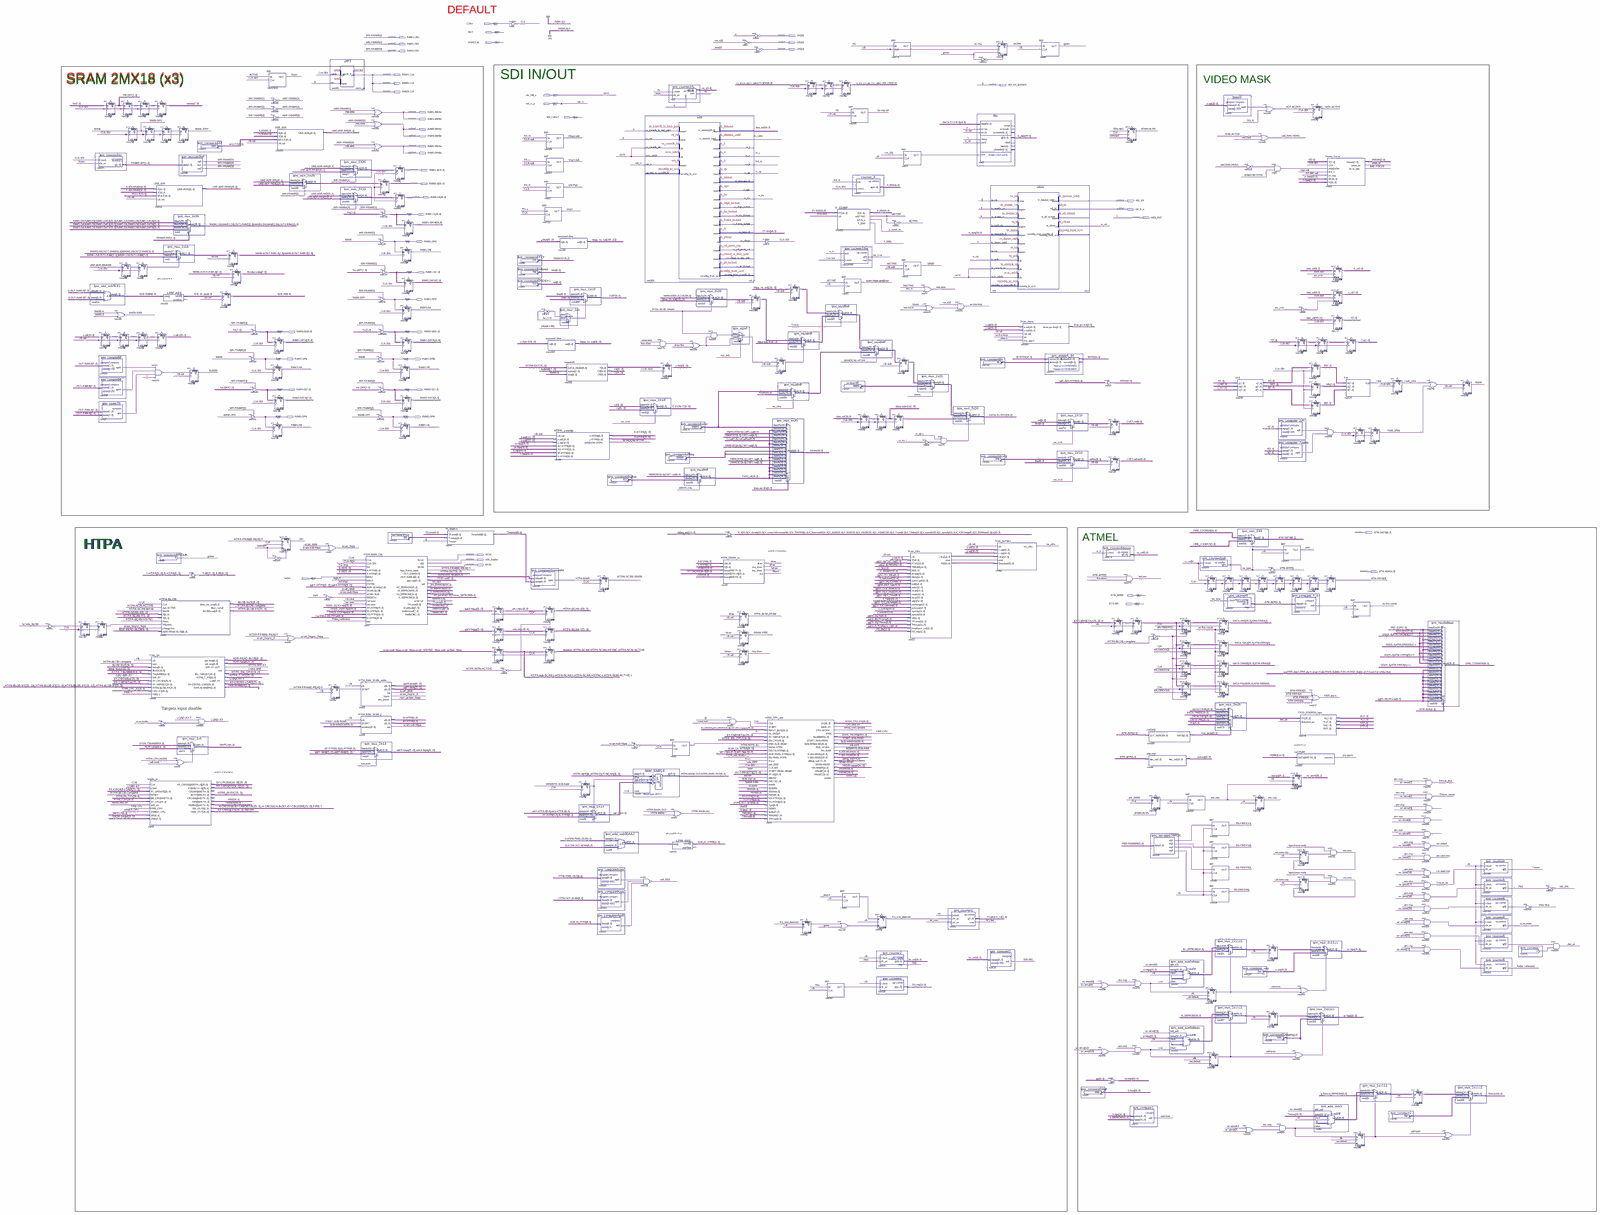
[diagram p0: schematic sheet, whole]
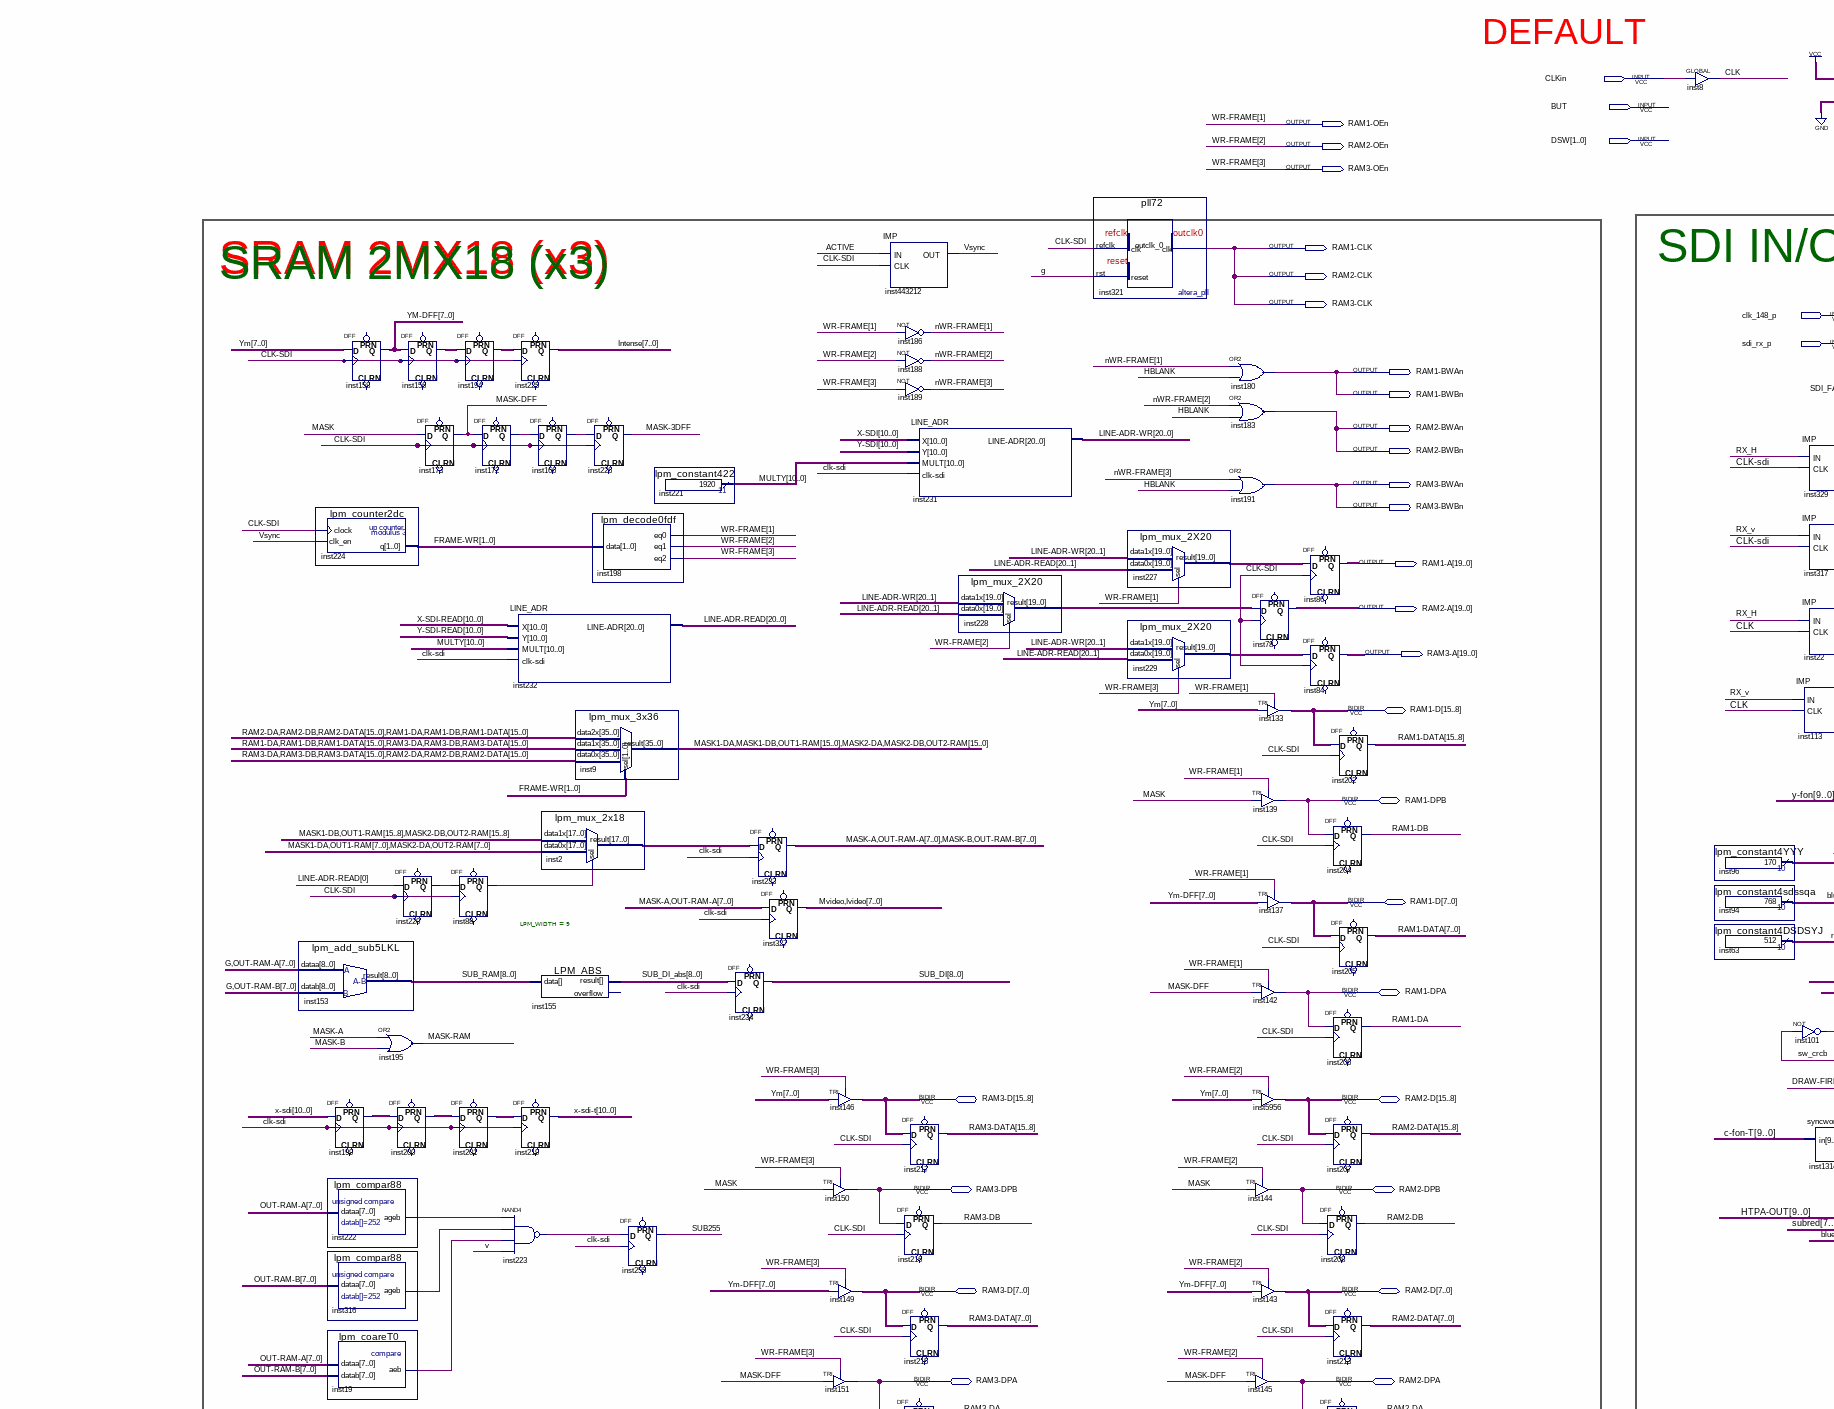
[diagram p1: schematic sheet, upper left part]
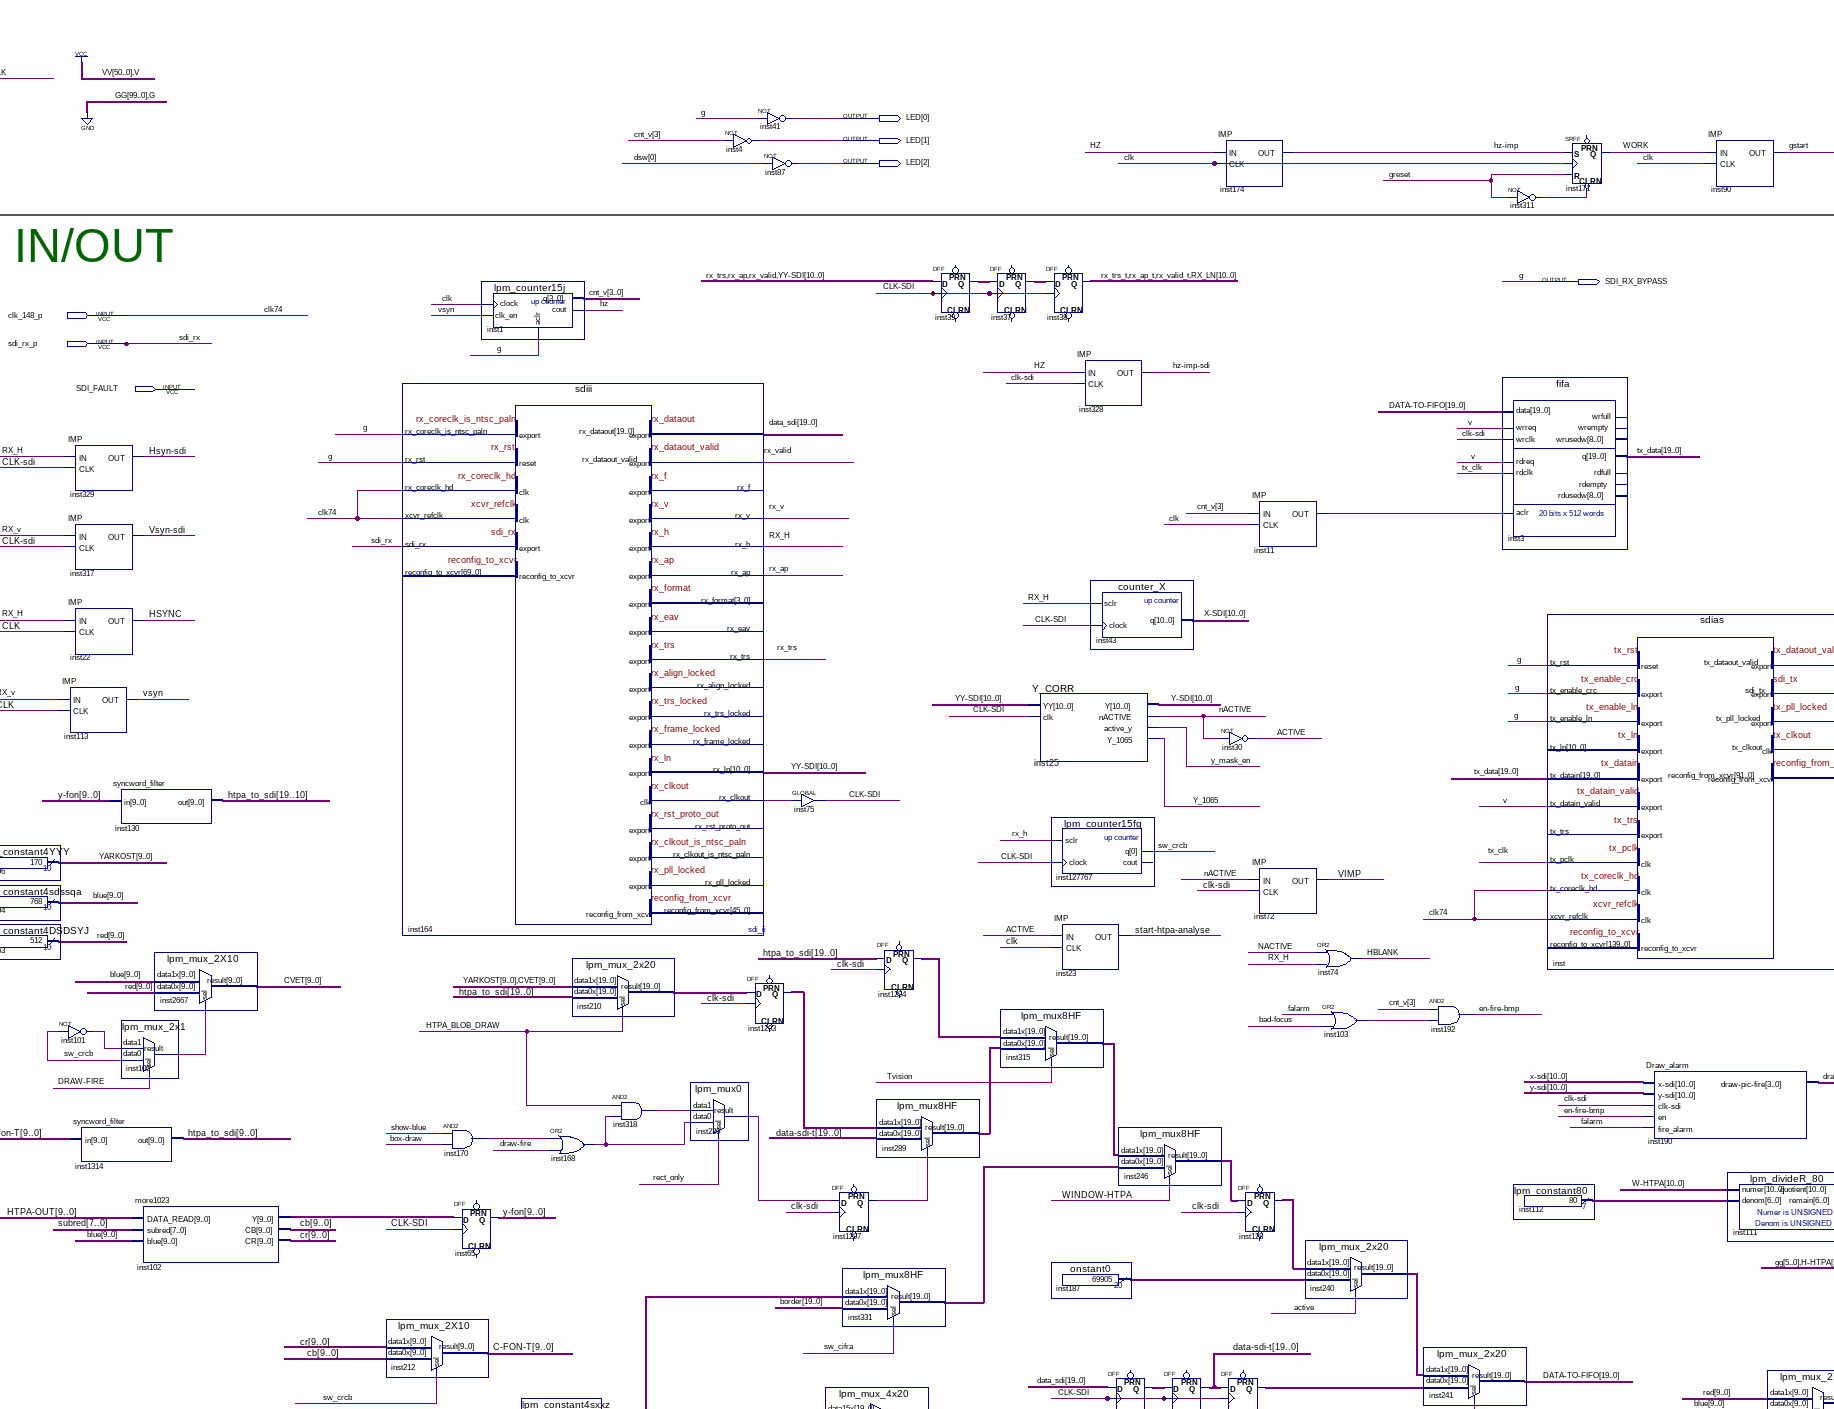
[diagram p2: schematic sheet, upper centre part]
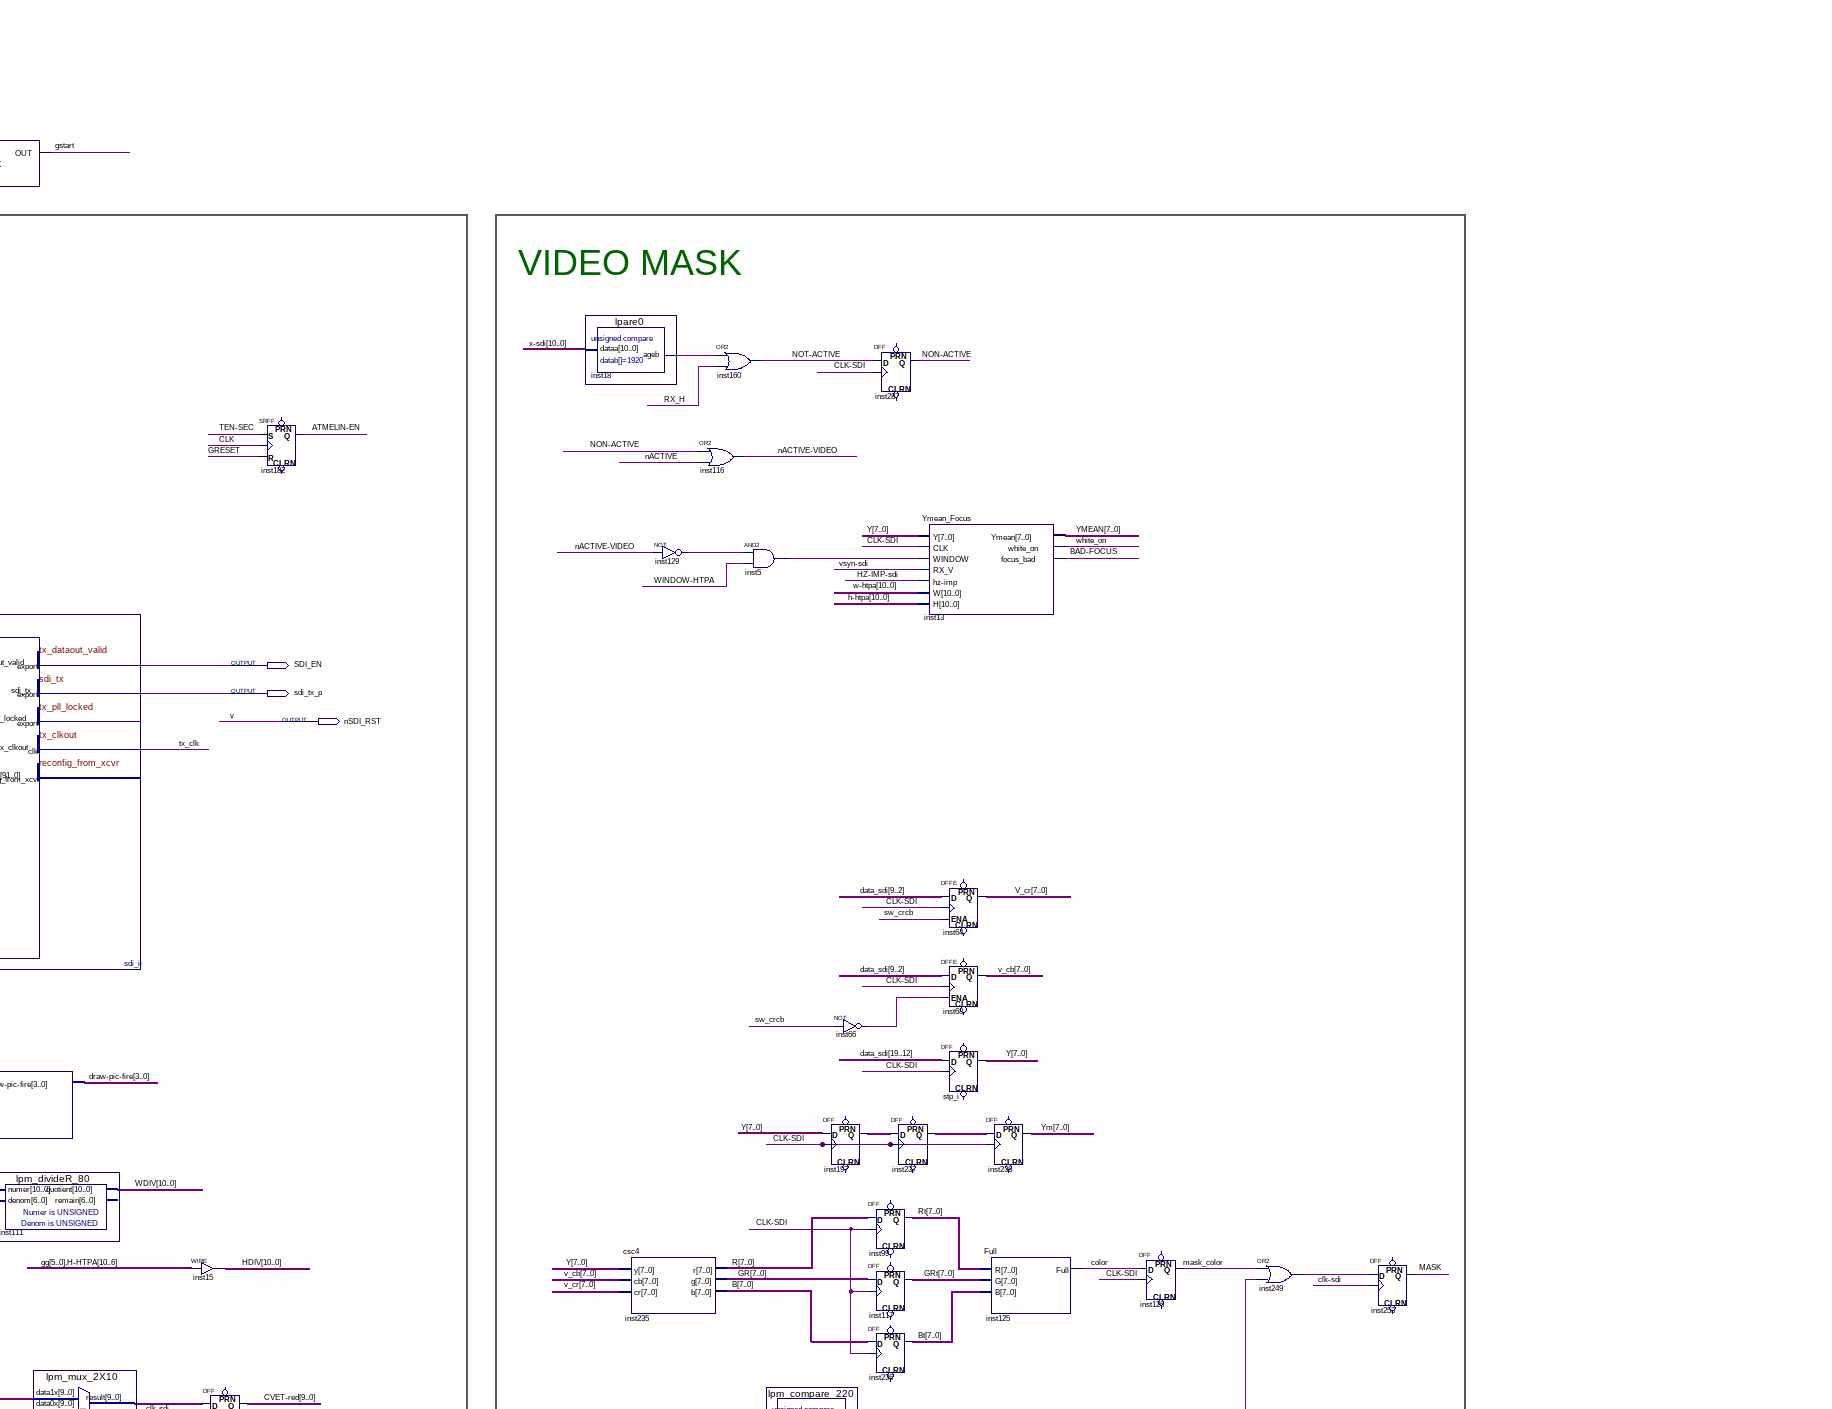
[diagram p3: schematic sheet, upper right part]
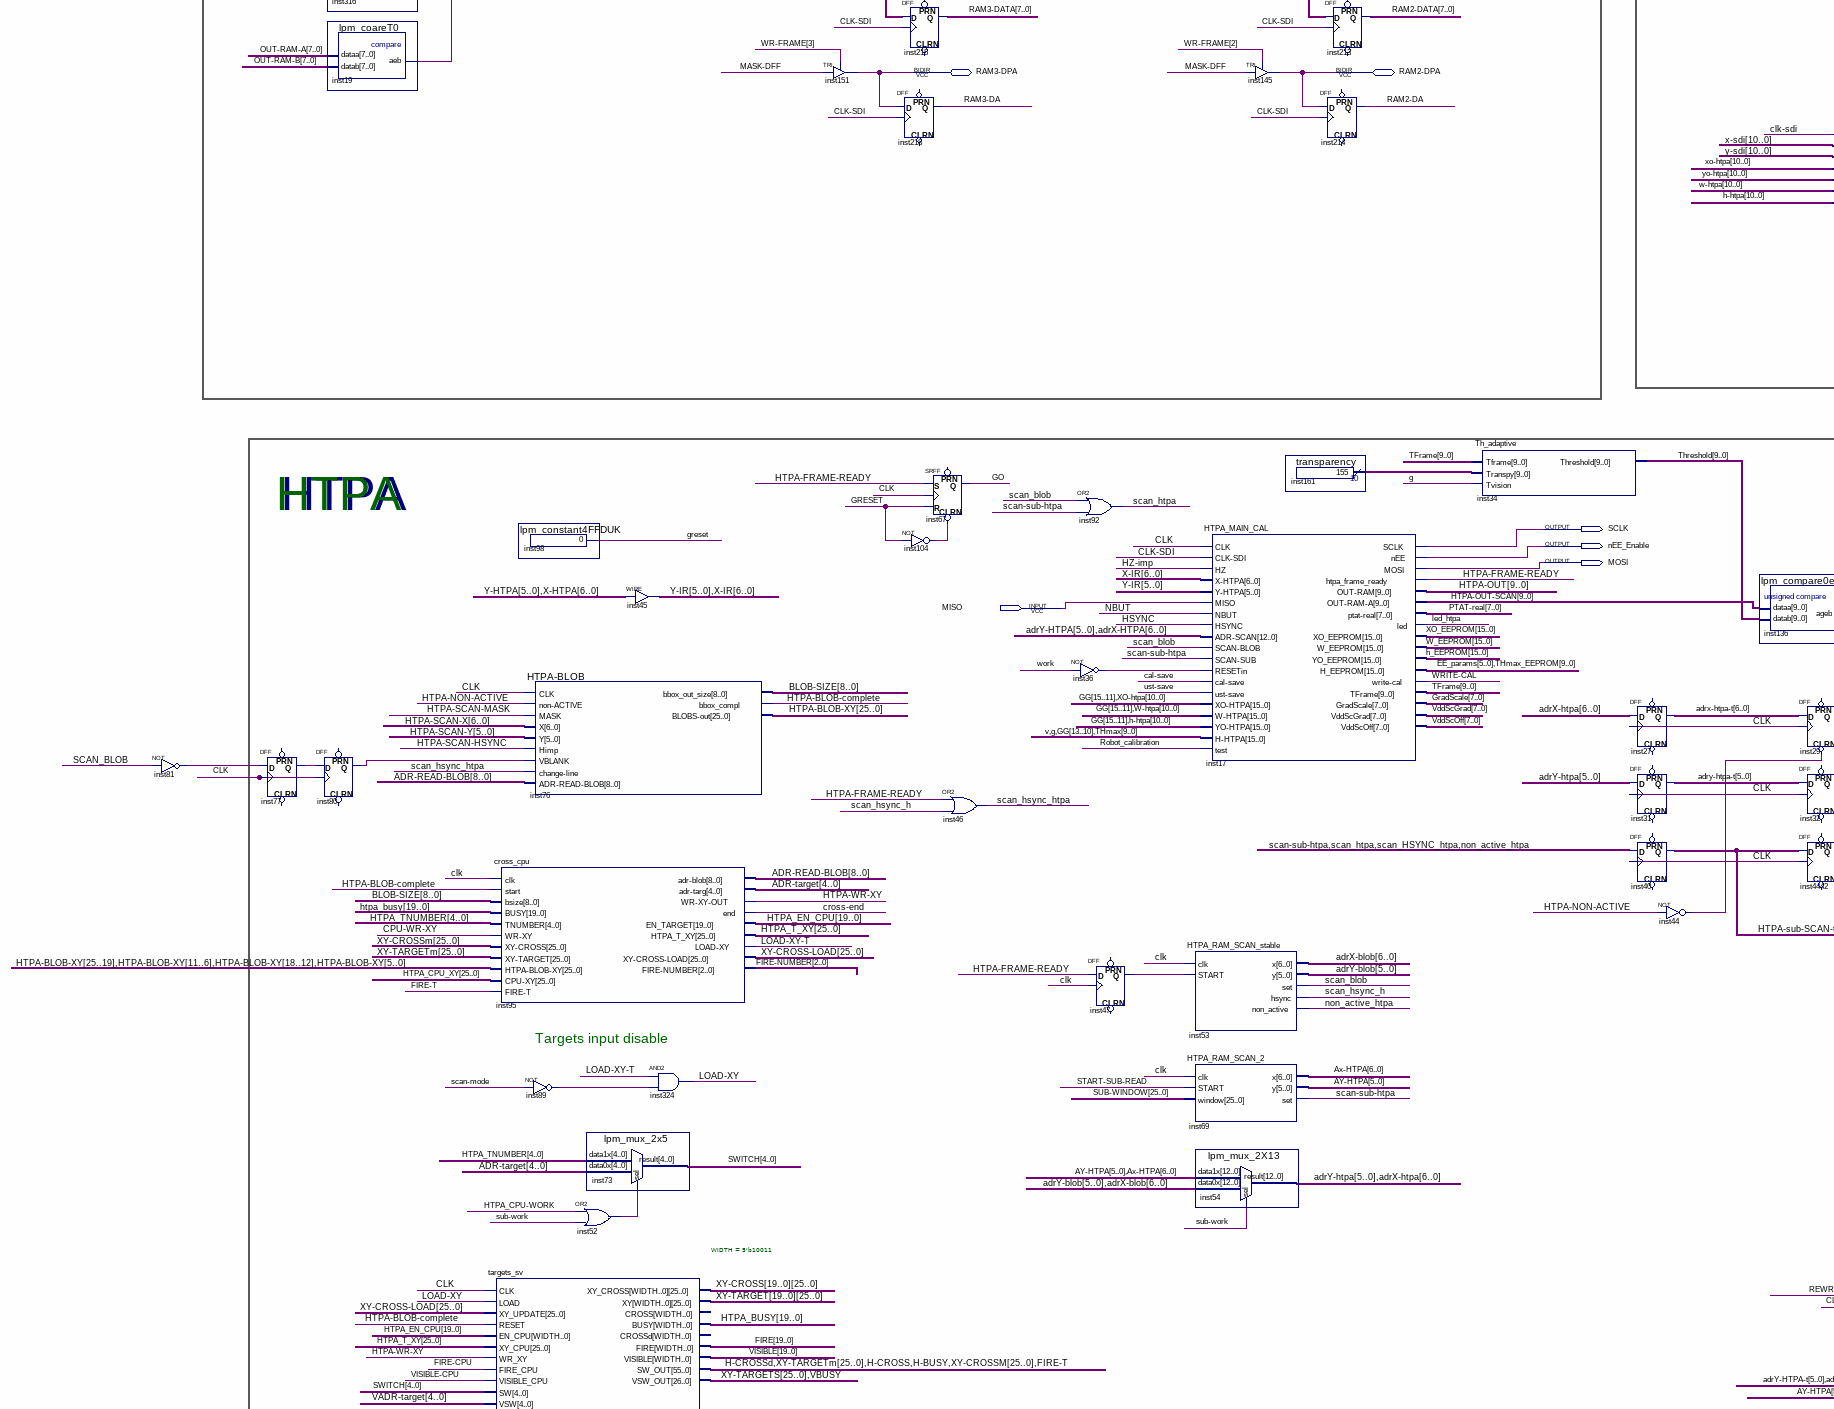
[diagram p4: schematic sheet, middle left part]
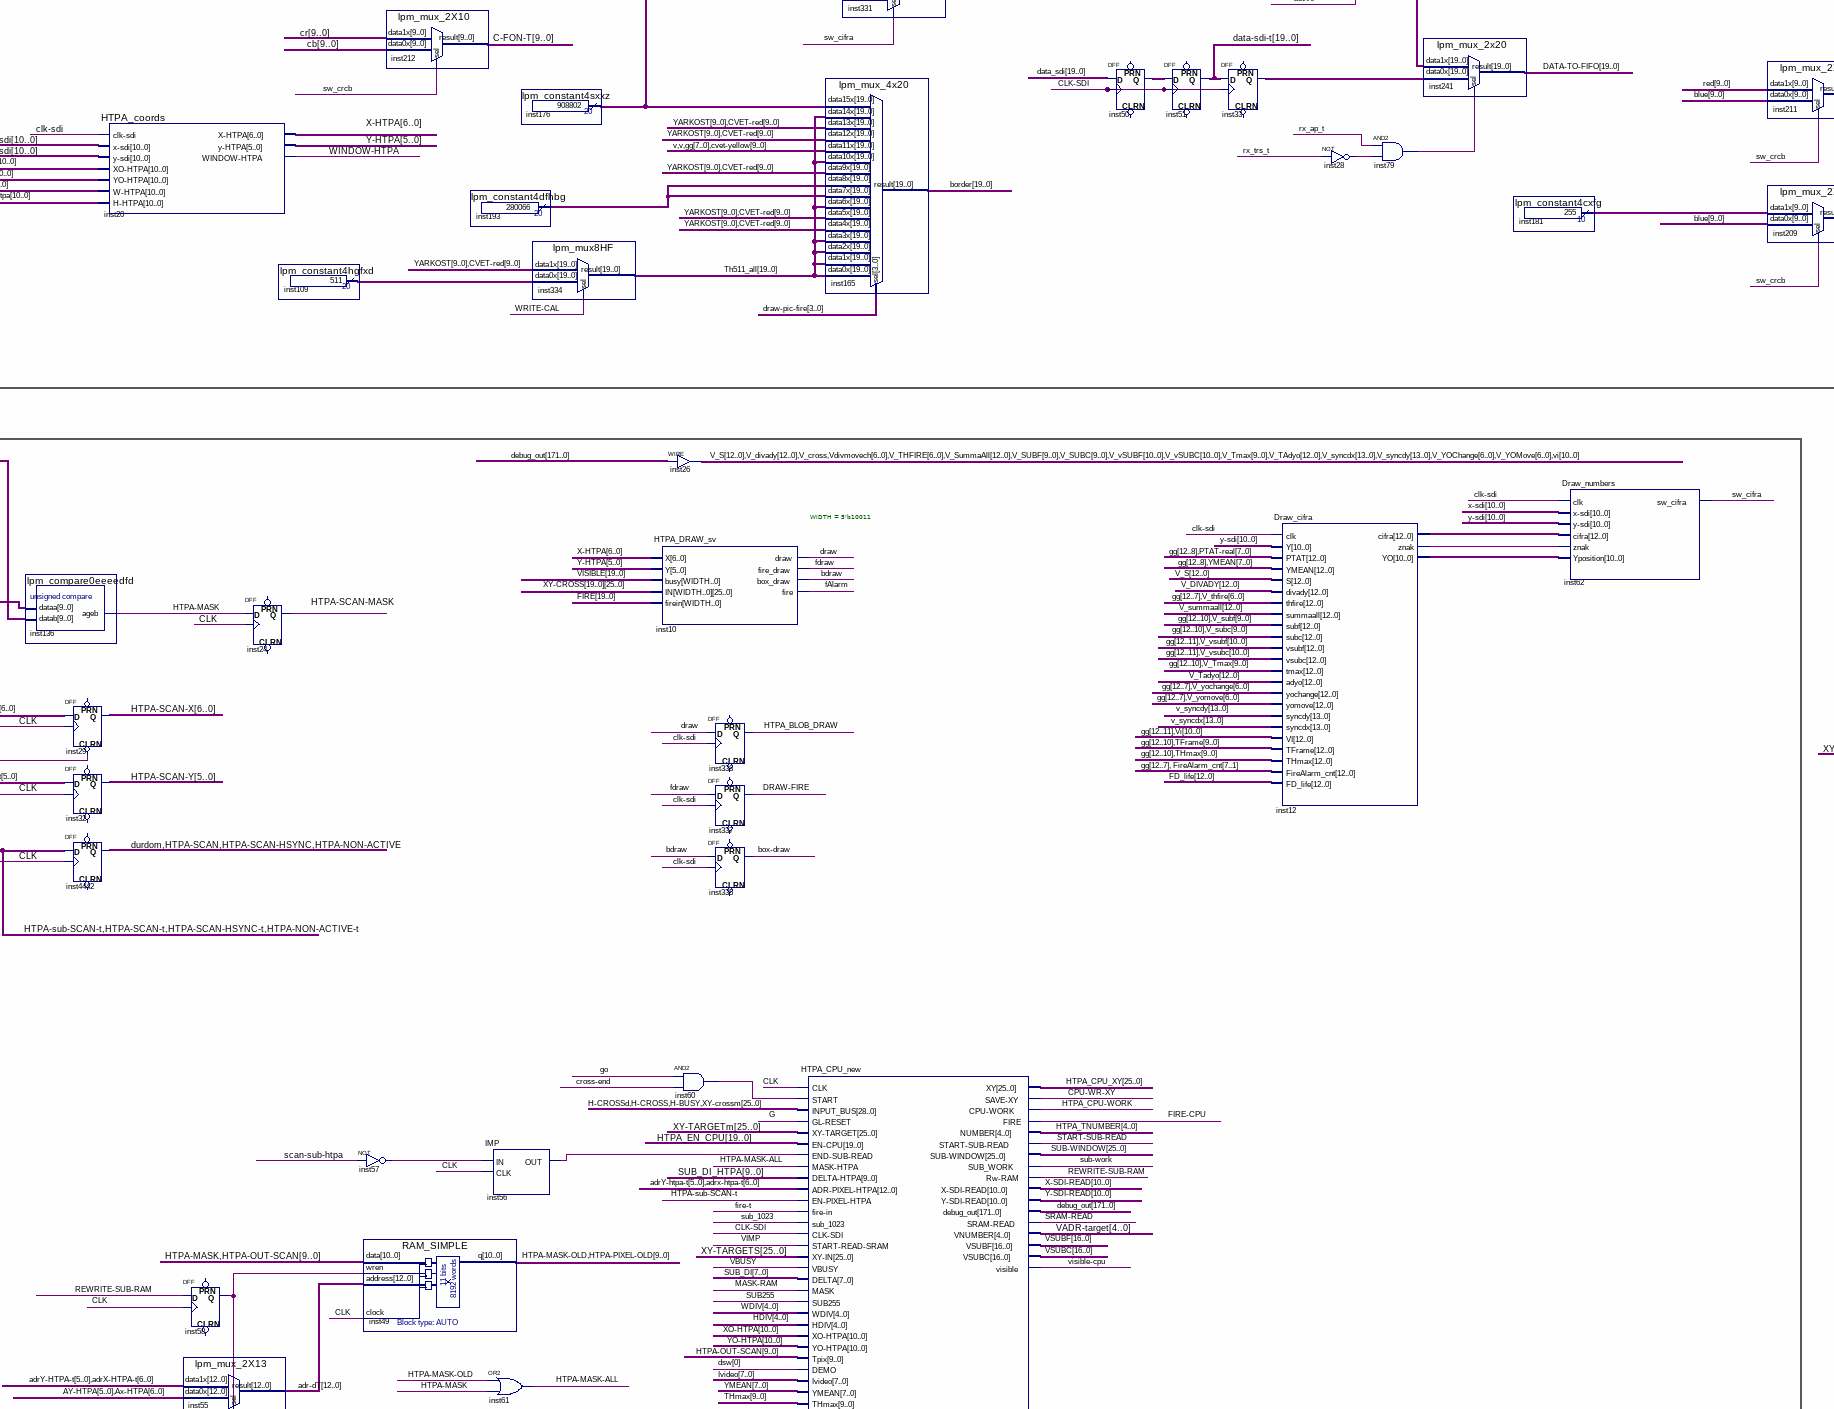
[diagram p5: schematic sheet, middle centre part]
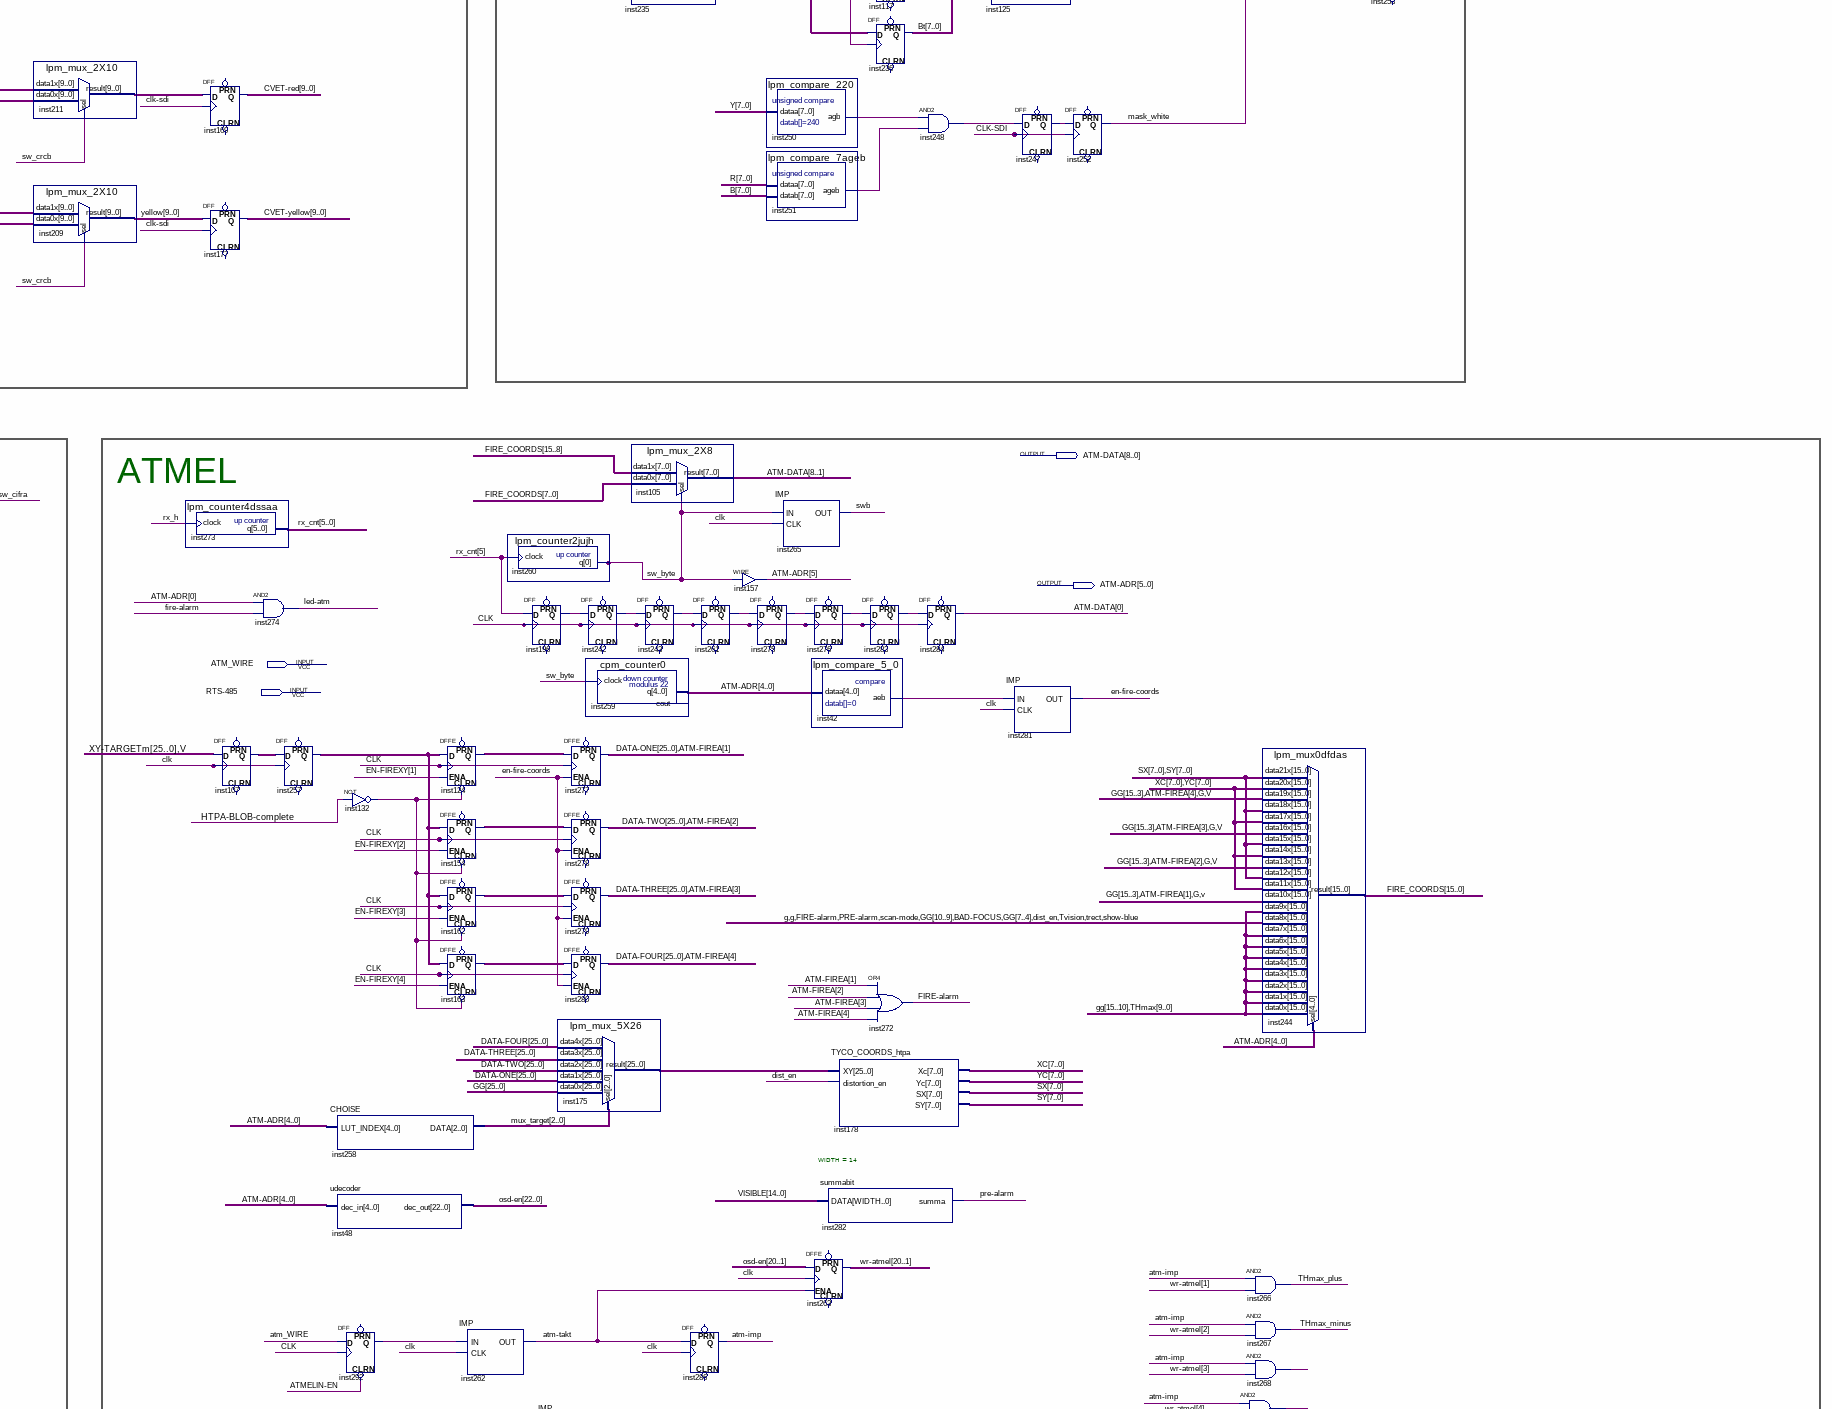
[diagram p6: schematic sheet, middle right part]
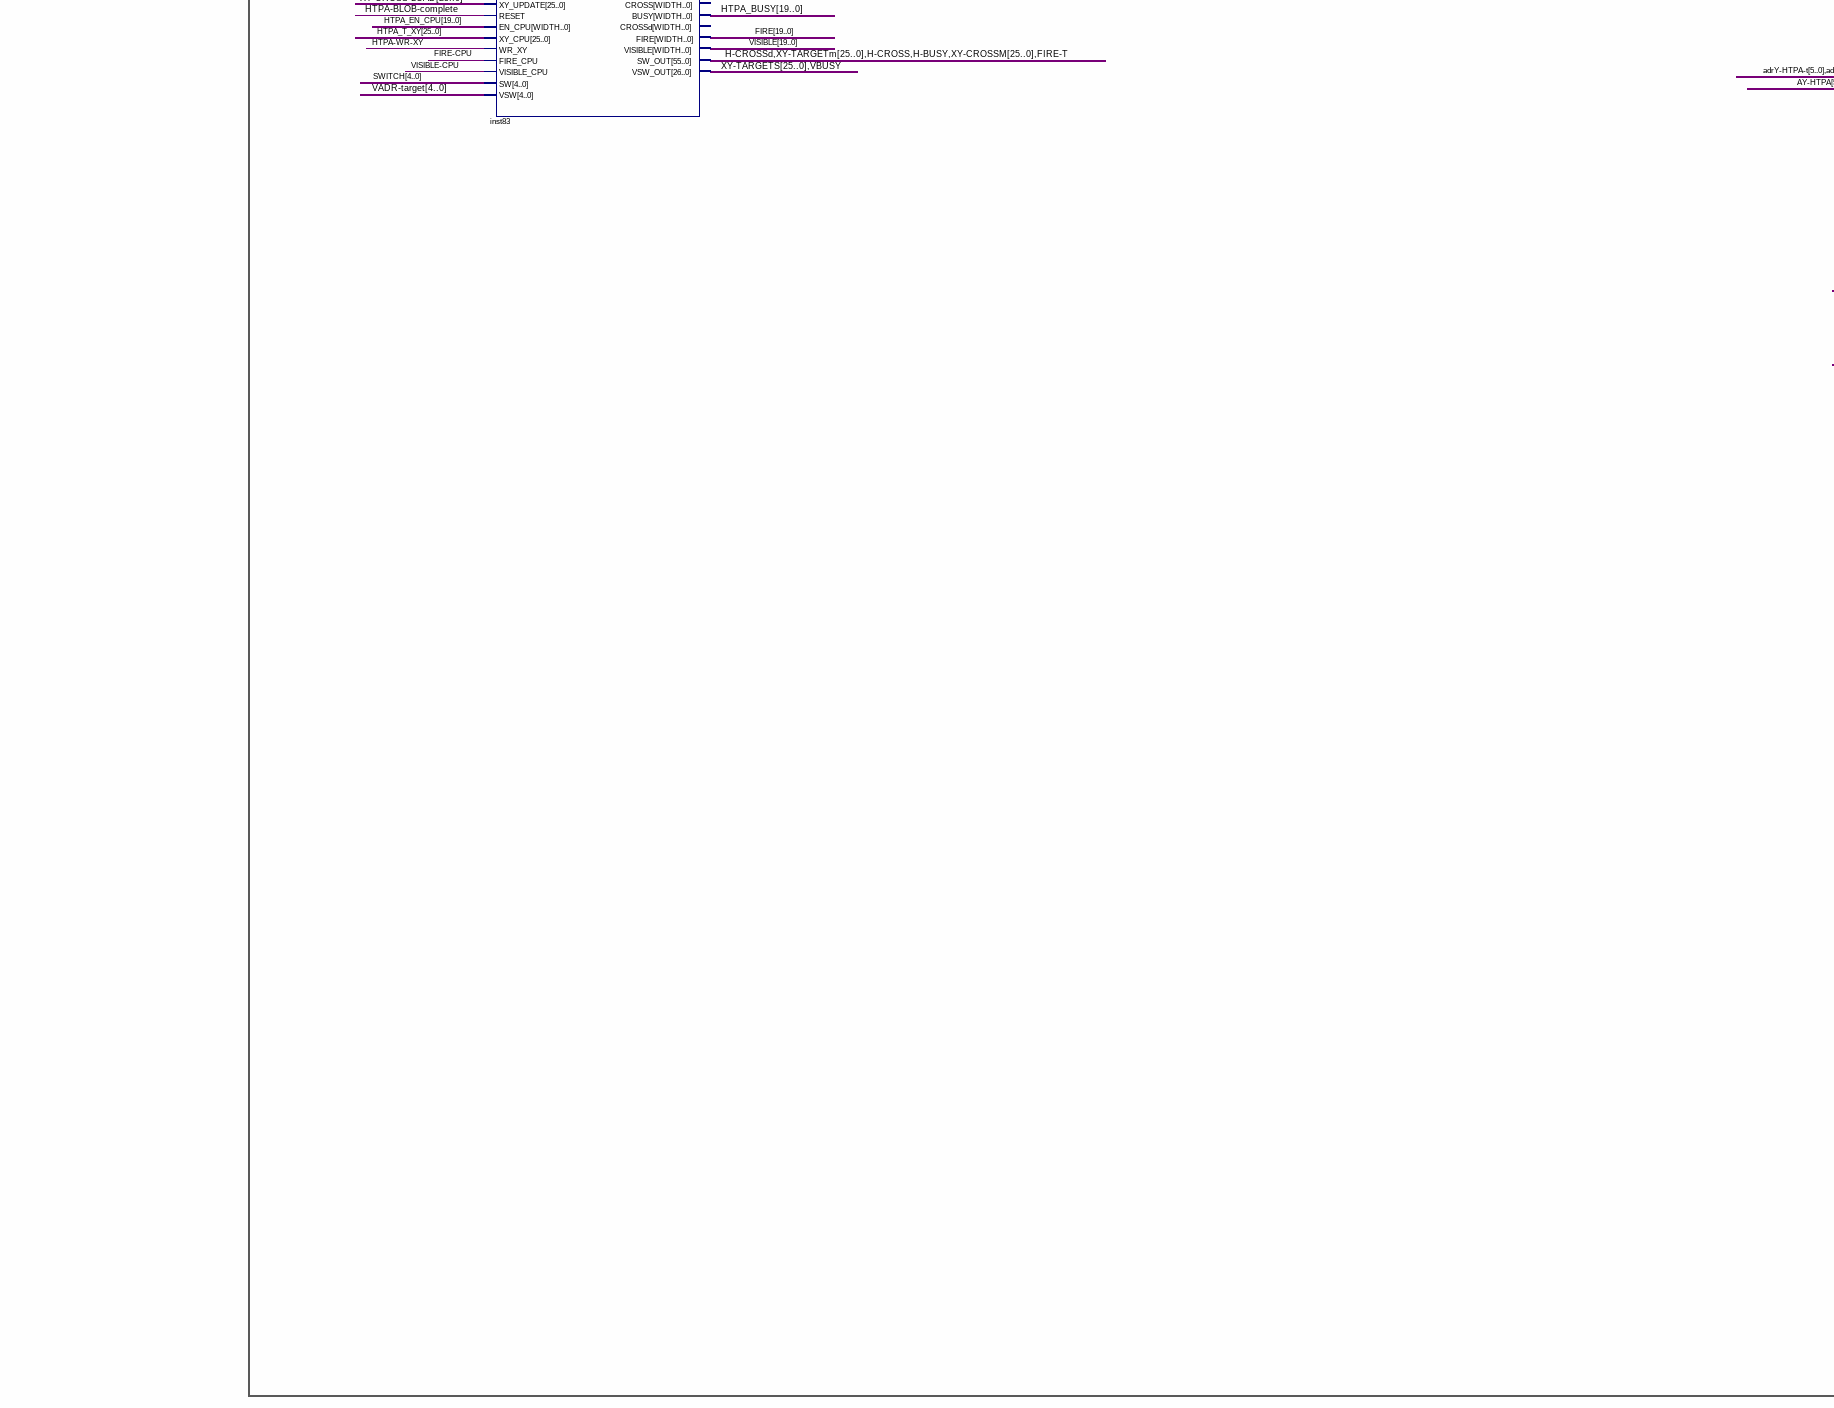
[diagram p7: schematic sheet, lower left part]
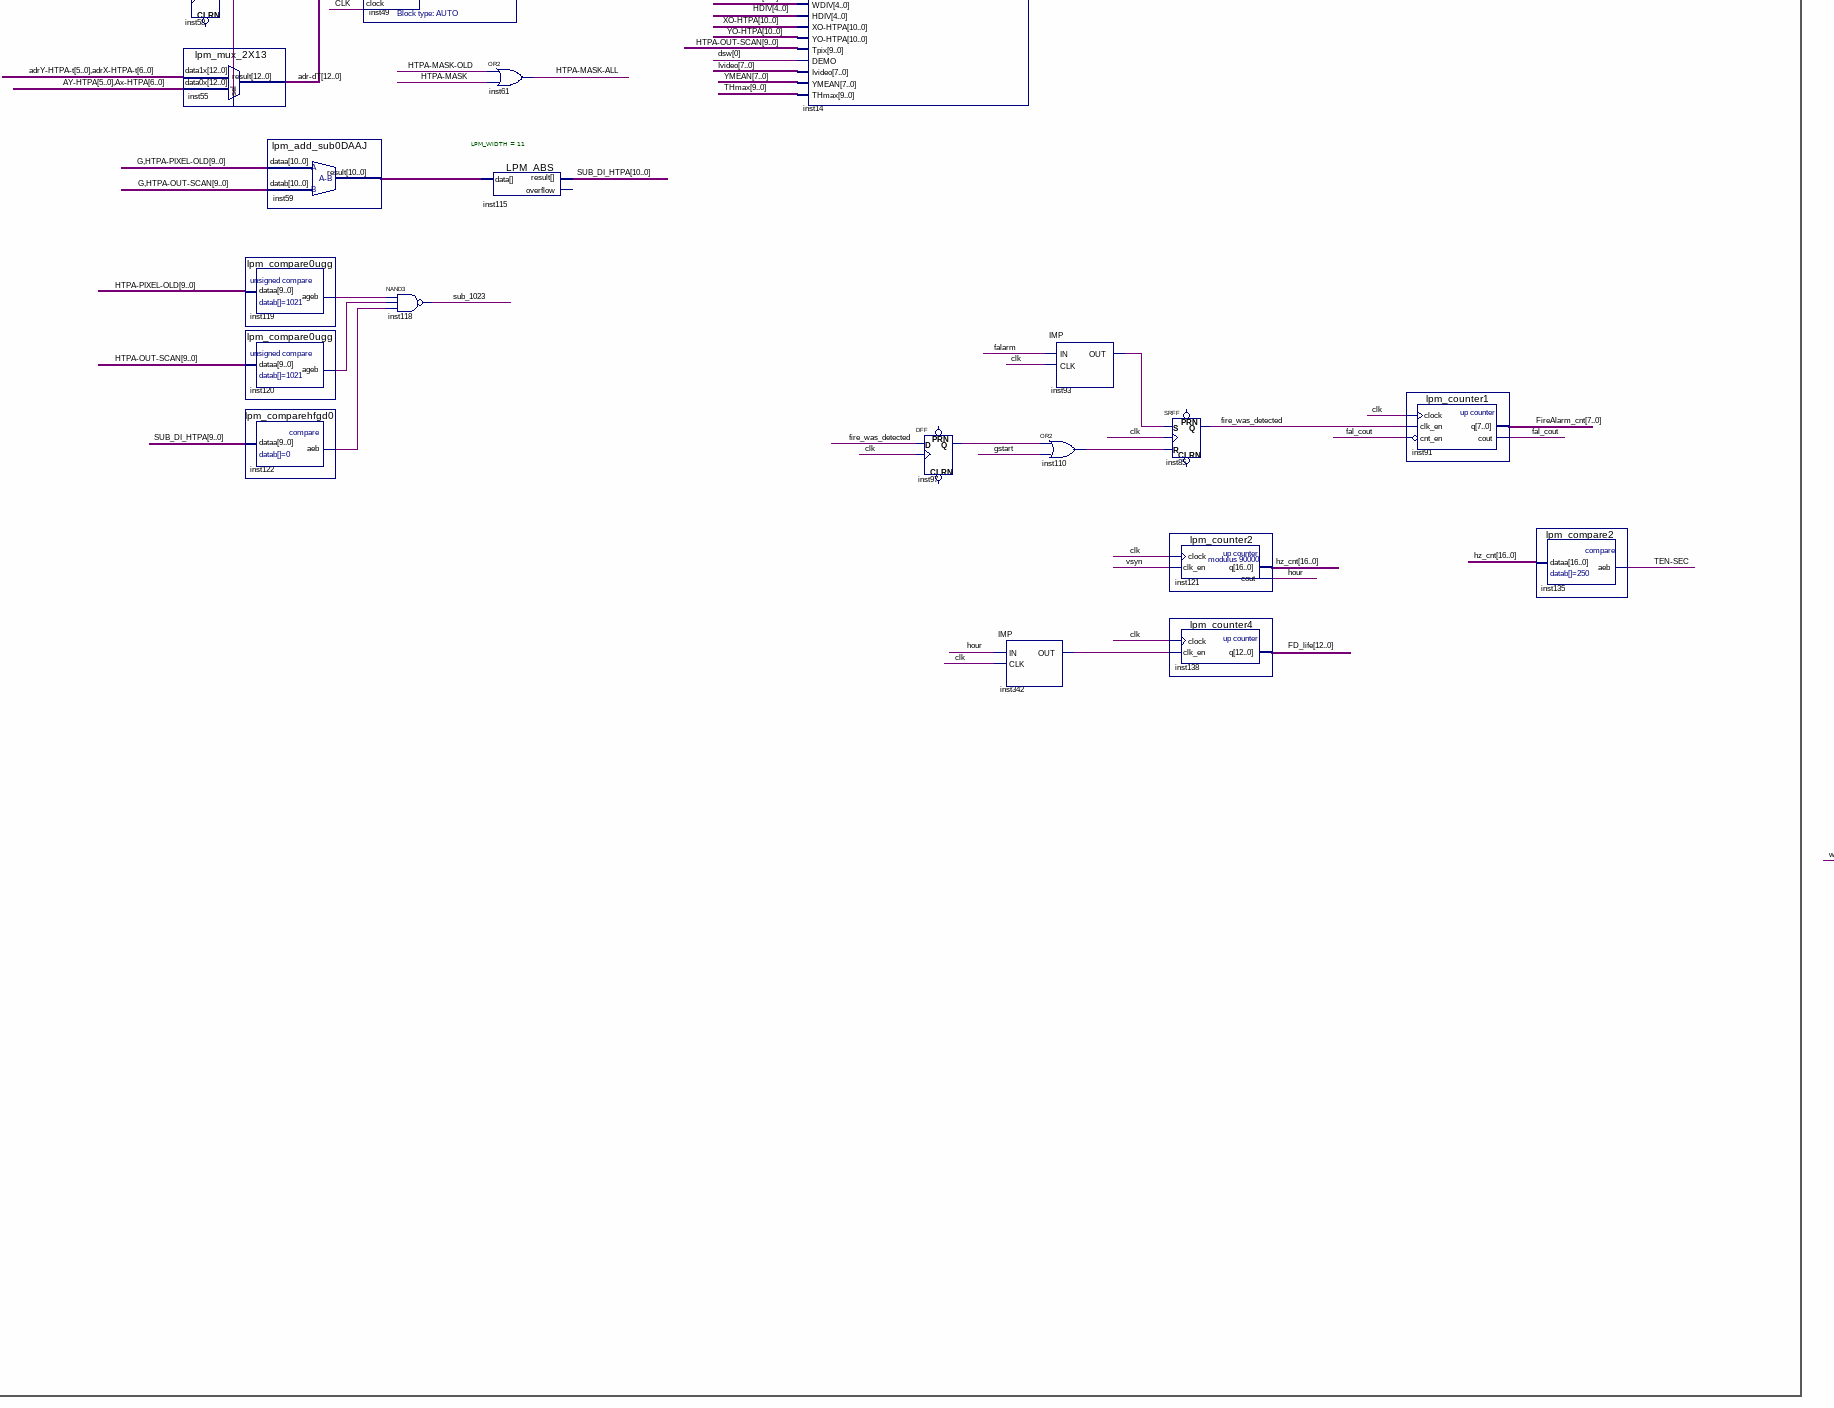
[diagram p8: schematic sheet, lower centre part]
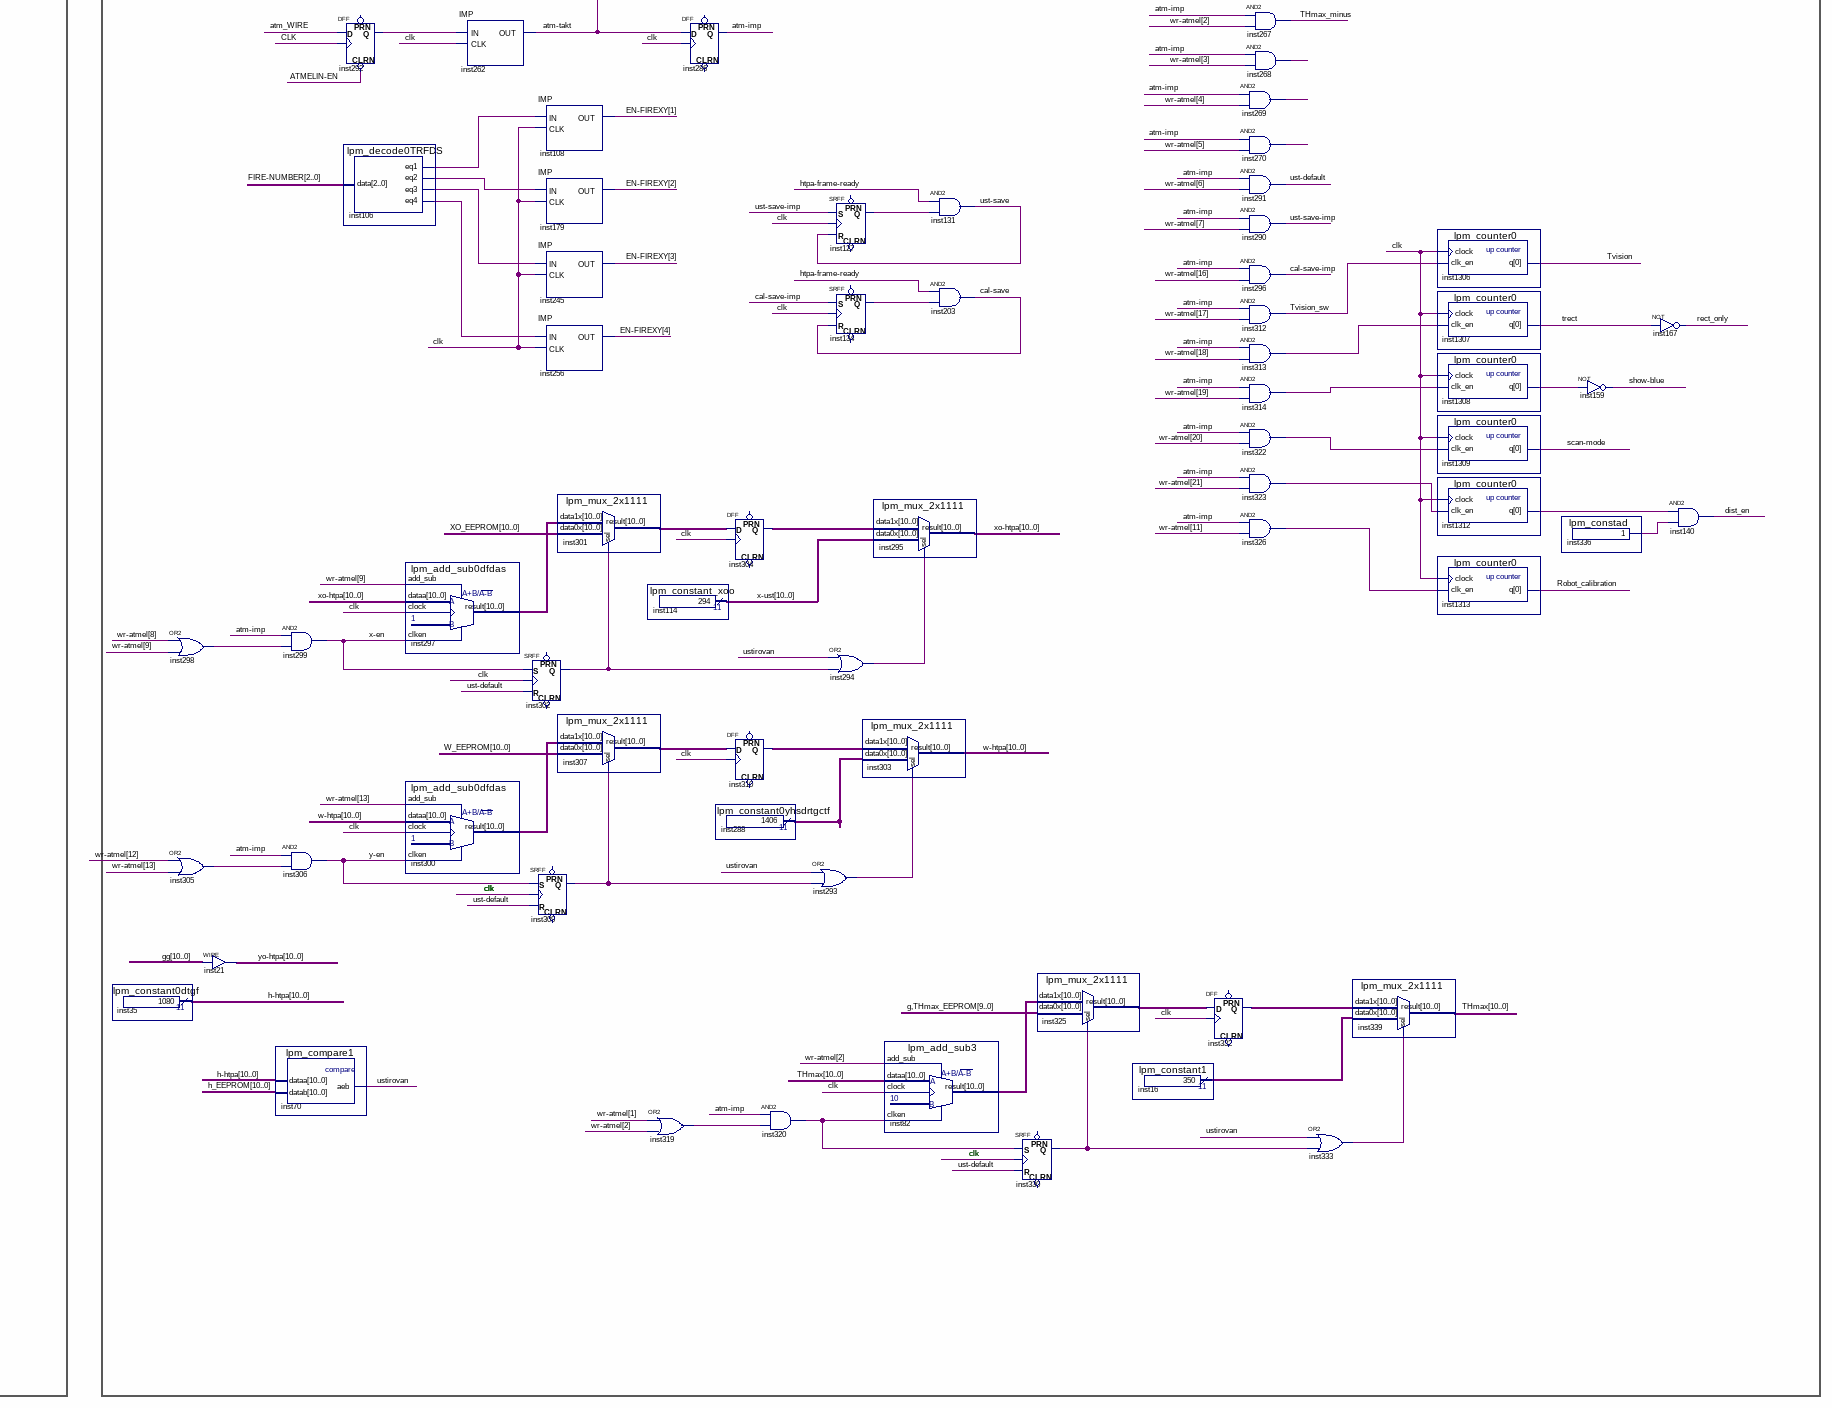
[diagram p9: schematic sheet, lower right part]
// Quartus schematic FD.bdf as structural Verilog: 341 symbols, 48 pins
module FD (
  input  CLKin,
  input  BUT,
  input  [1:0] DSW,
  input  clk_148_p,
  input  sdi_rx_p,
  input  SDI_FAULT,
  input  MISO,
  input  ATM_WIRE,
  input  \RTS-485 ,
  inout  [15:0] \RAM1-D ,
  inout  \RAM1-DPB ,
  inout  \RAM1-DPA ,
  inout  [15:0] \RAM3-D ,
  inout  [15:0] \RAM2-D ,
  inout  \RAM3-DPB ,
  inout  \RAM2-DPB ,
  inout  \RAM3-DPA ,
  inout  \RAM2-DPA ,
  output [2:0] LED,
  output \RAM1-OEn ,
  output \RAM2-OEn ,
  output \RAM3-OEn ,
  output \RAM1-CLK ,
  output \RAM2-CLK ,
  output SDI_RX_BYPASS,
  output \RAM3-CLK ,
  output \RAM1-BWAn ,
  output \RAM1-BWBn ,
  output \RAM2-BWAn ,
  output \RAM2-BWBn ,
  output \RAM3-BWAn ,
  output \RAM3-BWBn ,
  output [19:0] \RAM1-A ,
  output [19:0] \RAM2-A ,
  output [19:0] \RAM3-A ,
  output SDI_EN,
  output sdi_tx_p,
  output nSDI_RST,
  output [8:0] \ATM-DATA ,
  output SCLK,
  output nEE_Enable,
  output MOSI,
  output [5:0] \ATM-ADR 
);

  wire ACTIVE, \atm-imp , \atm-takt , \ATMELIN-EN , \bad-focus , bdraw, \box-draw , \cal-save ,
       \cal-save-imp , CLK, \clk-sdi , color, \CPU-WR-XY , \cross-end , dist_en, draw, \DRAW-FIRE , durdom,
       \en-fire-bmp , \en-fire-coords , fal_cout, falarm, fdraw, \fire-alarm , \FIRE-CPU , \FIRE-T ,
       fire_was_detected, GO, GRESET, gstart, \H-BUSY , \H-CROSS , \H-CROSSd , HBLANK, hour, \Hsyn-sdi ,
       HSYNC, \HTPA-BLOB-complete , \HTPA-FRAME-READY , \HTPA-MASK , \HTPA-MASK-ALL , \HTPA-MASK-OLD ,
       \HTPA-NON-ACTIVE , \HTPA-NON-ACTIVE-t , \HTPA-SCAN , \HTPA-SCAN-HSYNC , \HTPA-SCAN-HSYNC-t ,
       \HTPA-SCAN-MASK , \HTPA-SCAN-t , \HTPA-sub-SCAN-t , \HTPA-WR-XY , HTPA_BLOB_DRAW, \HTPA_CPU-WORK , HZ,
       \hz-imp , \hz-imp-sdi , inst5_out, inst11_out, inst12_znak, inst18_ageb, inst19_aeb, inst28_out,
       inst36_out, inst42_aeb, inst44_out, inst47_q, inst52_out, inst56_out, inst57_out, inst58_q,
       inst60_out, inst66_out, inst77_q, inst79_out, inst80_q, inst81_out, inst88_q, inst89_out, inst93_out,
       inst97_q, inst100_result, inst101_out, inst103_out, inst104_out, inst106_eq1, inst106_eq2,
       inst106_eq3, inst106_eq4, inst110_out, inst119_ageb, inst120_ageb, inst122_aeb, inst127_q,
       inst129_out, inst132_out, inst134_q, inst164_rx_clkout, inst166_q, inst168_out, inst170_out,
       inst172_q, inst196_q, inst220_q, inst222_ageb, inst223_out, inst230_result, inst242_q, inst243_q,
       inst247_q, inst248_out, inst249_out, inst250_agb, inst251_ageb, inst261_q, inst268_out, inst269_out,
       inst270_out, inst275_q, inst276_q, inst283_q, inst292_q, inst293_out, inst294_out, inst298_out,
       inst302_q, inst305_out, inst309_q, inst311_out, inst313_out, inst314_out, inst316_ageb, inst318_out,
       inst319_out, inst320_out, inst322_out, inst323_out, inst326_out, inst330_q, inst333_out,
       inst336_result, inst342_out, inst1297_q, inst1308_q, inst1312_q, \led-atm , led_htpa, \LOAD-XY ,
       \LOAD-XY-T , MASK, \MASK1-DA , \MASK1-DB , \MASK2-DA , \MASK2-DB , \MASK-3DFF , \MASK-A , \MASK-B ,
       \MASK-DFF , \MASK-RAM , mask_color, mask_white, Mvideo, nACTIVE, \nACTIVE-VIDEO , NBUT, \NON-ACTIVE ,
       non_active_htpa, \NOT-ACTIVE , \PRE-alarm , \RAM1-DA , \RAM1-DB , \RAM2-DA , \RAM2-DB , \RAM3-DA ,
       \RAM3-DB , rect_only, \REWRITE-SUB-RAM , Robot_calibration, rx_ap, rx_ap_t, RX_H, rx_trs, rx_trs_t,
       RX_v, rx_valid, rx_valid_t, \scan-mode , \scan-sub-htpa , SCAN_BLOB, scan_hsync_h, scan_hsync_htpa,
       scan_htpa, \show-blue , \SRAM-READ , \start-htpa-analyse , \START-SUB-READ , SUB255, \sub-work ,
       sub_1023, sw_byte, sw_cifra, sw_crcb, swb, \TEN-SEC , THmax_minus, THmax_plus, trect, Tvision,
       Tvision_sw, tx_clk, \ust-default , \ust-save , \ust-save-imp , ustirovan, V_cross, VBUSY, VIMP,
       \VISIBLE-CPU , vsyn, \Vsyn-sdi , Vsync, white_on, \WINDOW-HTPA , work, \WRITE-CAL , \x-en , \y-en ,
       Y_1065, y_mask_en;
  wire [1:0] \FRAME-WR ;
  wire [2:0] \FIRE-NUMBER , mux_target;
  wire [3:0] cnt_v, \draw-pic-fire ;
  wire [3:1] \nWR-FRAME ;
  wire [4:0] \ADR-target , HTPA_TNUMBER, SWITCH, \VADR-target ;
  wire [4:1] \ATM-FIREA , \EN-FIREXY ;
  wire [5:0] \adrY-blob , \adrY-htpa , \adry-htpa-t , \AY-HTPA , EE_params, \HTPA-SCAN-Y , rx_cnt, \Y-HTPA ,
       \Y-IR ;
  wire [6:0] \adrX-blob , \adrX-htpa , \adrx-htpa-t , \Ax-HTPA , \HTPA-SCAN-X , inst112_result, V_THFIRE,
       V_YOChange, V_YOMove, Vdivmovech, \X-HTPA , \X-IR ;
  wire [7:0] B, Bt, FireAlarm_cnt, GR, GradScale, GRt, inst156_q, inst194_q, inst197_q, inst237_q, Intense,
       Ivideo, \OUT-RAM-A , \OUT-RAM-B , \PTAT-real , R, Rt, subred, SX, SY, v_cb, V_cr, VddScGrad, VddScOff,
       XC, Y, YC, Ym, \Ym-DFF , YMEAN;
  wire [8:0] \ADR-READ-BLOB , \BLOB-SIZE , SUB_DI, SUB_DI_abs, SUB_RAM;
  wire [9:0] blue, \c-fon-T , cb, cr, CVET, \CVET-red , \CVET-yellow , \HTPA-OUT , \HTPA-OUT-SCAN ,
       \HTPA-PIXEL-OLD , inst102_y, inst161_result, inst181_result, inst211_result, red, TFrame,
       THmax_EEPROM, Threshold, V_SUBC, V_SUBF, V_Tmax, \y-fon , YARKOST, yellow;
  wire [10:0] \H-HTPA , HDIV, inst12_yo, inst16_result, inst59_result, inst82_result, inst199_q, inst200_q,
       inst201_q, inst288_result, inst297_result, inst300_result, inst301_result, inst304_q, inst307_result,
       inst310_q, inst325_result, inst332_q, MULTY, RX_LN, SUB_DI_HTPA, THmax, V_vSUBC, V_vSUBF, vi,
       \W-HTPA , WDIV, \x-sdi , \X-SDI-READ , \x-sdi-t , \x-ust , \xo-htpa , \Y-SDI , \Y-SDI-READ ,
       \yo-htpa , \YY-SDI ;
  wire [12:0] \adr-dT , FD_life, inst12_cifra, V_divady, V_S, V_SummaAll, V_TAdyo;
  wire [13:0] inst37_q, inst39_q, V_syncdx, V_syncdy;
  wire [15:0] FIRE_COORDS, h_EEPROM, \OUT1-RAM , \OUT2-RAM , \RAM1-DATA , \RAM2-DATA , \RAM3-DATA , W_EEPROM,
       XO_EEPROM;
  wire [16:0] hz_cnt, VSUBC, VSUBF;
  wire [17:0] inst2_result;
  wire [19:0] border, \data-sdi-t , \DATA-TO-FIFO , data_sdi, FIRE, HTPA_BUSY, HTPA_EN_CPU, htpa_to_sdi,
       inst33_q, inst50_q, inst109_result, inst128_q, inst176_result, inst187_result, inst193_result,
       inst210_result, inst227_result, inst228_result, inst229_result, inst240_result, inst246_result,
       inst289_result, inst315_result, inst331_result, inst1293_q, inst1294_q, Th511_all, tx_data, VISIBLE;
  wire [20:0] \LINE-ADR-READ , \LINE-ADR-WR ;
  wire [21:1] \wr-atmel ;
  wire [22:0] \osd-en ;
  wire [25:0] \DATA-FOUR , \DATA-ONE , \DATA-THREE , \DATA-TWO , \HTPA-BLOB-XY , HTPA_CPU_XY, HTPA_T_XY,
       inst175_result, \SUB-WINDOW , \XY-CROSS-LOAD , \XY-CROSS_0 , \XY-CROSS_1 , \XY-CROSS_2 , \XY-CROSS_3 ,
       \XY-CROSS_4 , \XY-CROSS_5 , \XY-CROSS_6 , \XY-CROSS_7 , \XY-CROSS_8 , \XY-CROSS_9 , \XY-CROSS_10 ,
       \XY-CROSS_11 , \XY-CROSS_12 , \XY-CROSS_13 , \XY-CROSS_14 , \XY-CROSS_15 , \XY-CROSS_16 ,
       \XY-CROSS_17 , \XY-CROSS_18 , \XY-CROSS_19 , \XY-CROSSM , \XY-TARGET_0 , \XY-TARGET_1 , \XY-TARGET_2 ,
       \XY-TARGET_3 , \XY-TARGET_4 , \XY-TARGET_5 , \XY-TARGET_6 , \XY-TARGET_7 , \XY-TARGET_8 ,
       \XY-TARGET_9 , \XY-TARGET_10 , \XY-TARGET_11 , \XY-TARGET_12 , \XY-TARGET_13 , \XY-TARGET_14 ,
       \XY-TARGET_15 , \XY-TARGET_16 , \XY-TARGET_17 , \XY-TARGET_18 , \XY-TARGET_19 , \XY-TARGETm ,
       \XY-TARGETS ;
  wire [26:0] inst107_q, inst124_q, inst154_q, inst162_q, inst163_q, inst257_q;
  wire [171:0] debug_out;

  not inst81 (inst81_out, SCAN_BLOB);
  DFF inst77 (.CLK(CLK), .D(inst81_out), .Q(inst77_q));  // open: CLRN, PRN
  lpm_counter2dc inst224 (.clock(\clk-sdi ), .clk_en(Vsync), .q(\FRAME-WR ));
  lpm_add_sub5LKL inst153 (.dataa({1'b0, \OUT-RAM-A }), .datab({1'b0, \OUT-RAM-B }), .result(SUB_RAM));
  DFF inst199[10:0] (.CLK(\clk-sdi ), .D(\x-sdi ), .Q(inst199_q));  // open: CLRN, PRN
  lpm_compar88 inst222 (.dataa(\OUT-RAM-A ), .ageb(inst222_ageb));
  lpm_compar88 inst316 (.dataa(\OUT-RAM-B ), .ageb(inst316_ageb));
  lpm_coareT0 inst19 (.dataa(\OUT-RAM-A ), .datab(\OUT-RAM-B ), .aeb(inst19_aeb));
  DFF inst80 (.CLK(CLK), .D(inst77_q), .Q(inst80_q));  // open: CLRN, PRN
  DFF inst158[7:0] (.CLK(\clk-sdi ), .D(Ym), .Q(\Ym-DFF ));  // open: CLRN, PRN
  or inst195 (\MASK-RAM , \MASK-A , \MASK-B );
  DFF inst156[7:0] (.CLK(\clk-sdi ), .D(\Ym-DFF ), .Q(inst156_q));  // open: CLRN, PRN
  DFF inst173 (.CLK(\clk-sdi ), .D(MASK), .Q(\MASK-DFF ));  // open: CLRN, PRN
  DFF inst220 (.CLK(\clk-sdi ), .D(\LINE-ADR-READ [0]), .Q(inst220_q));  // open: CLRN, PRN
  DFF inst200[10:0] (.CLK(\clk-sdi ), .D(inst199_q), .Q(inst200_q));  // open: CLRN, PRN
  DFF inst194[7:0] (.CLK(\clk-sdi ), .D(inst156_q), .Q(inst194_q));  // open: CLRN, PRN
  DFF inst172 (.CLK(\clk-sdi ), .D(\MASK-DFF ), .Q(inst172_q));  // open: CLRN, PRN
  DFF inst88 (.CLK(\clk-sdi ), .D(inst220_q), .Q(inst88_q));  // open: CLRN, PRN
  DFF inst201[10:0] (.CLK(\clk-sdi ), .D(inst200_q), .Q(inst201_q));  // open: CLRN, PRN
  DFF inst225[7:0] (.CLK(\clk-sdi ), .D(inst194_q), .Q(Intense));  // open: CLRN, PRN
  LINE_ADR inst232 (
    .X(\X-SDI-READ ), .Y(\Y-SDI-READ ), .MULT(MULTY), .\clk-sdi (\clk-sdi ), .\LINE-ADR (\LINE-ADR-READ ));
  DFF inst219[10:0] (.CLK(\clk-sdi ), .D(inst201_q), .Q(\x-sdi-t ));  // open: CLRN, PRN
  nand inst223 (inst223_out, inst222_ageb, inst316_ageb, inst19_aeb, 1'b1);
  lpm_constant4FFDUK inst98 (.result(GRESET));
  cross_cpu inst95 (
    .clk(CLK), .start(\HTPA-BLOB-complete ), .bsize(\BLOB-SIZE ), .BUSY(HTPA_BUSY), .TNUMBER(HTPA_TNUMBER),
    .\WR-XY (\CPU-WR-XY ), .\XY-CROSS (\XY-CROSSM ), .\XY-TARGET (\XY-TARGETm ),
    .\HTPA-BLOB-XY ({\HTPA-BLOB-XY [25:19], \HTPA-BLOB-XY [11:6], \HTPA-BLOB-XY [18:12], \HTPA-BLOB-XY [5:0]}),
    .\CPU-XY (HTPA_CPU_XY), .\FIRE-T (\FIRE-T ), .\adr-blob (\ADR-READ-BLOB ), .\adr-targ (\ADR-target ),
    .\WR-XY-OUT (\HTPA-WR-XY ), .\end (\cross-end ), .EN_TARGET(HTPA_EN_CPU), .HTPA_T_XY(HTPA_T_XY),
    .\LOAD-XY (\LOAD-XY-T ), .\XY-CROSS-LOAD (\XY-CROSS-LOAD ), .\FIRE-NUMBER (\FIRE-NUMBER ));
  targets_sv #(.WIDTH(5'b10011)) inst83 (
    .CLK(CLK), .LOAD(\LOAD-XY ), .XY_UPDATE(\XY-CROSS-LOAD ), .RESET(\HTPA-BLOB-complete ),
    .EN_CPU(HTPA_EN_CPU), .XY_CPU(HTPA_T_XY), .WR_XY(\HTPA-WR-XY ), .FIRE_CPU(\FIRE-CPU ),
    .VISIBLE_CPU(\VISIBLE-CPU ), .SW(SWITCH), .VSW(\VADR-target ),
    .XY_CROSS({\XY-CROSS_19 , \XY-CROSS_18 , \XY-CROSS_17 , \XY-CROSS_16 , \XY-CROSS_15 , \XY-CROSS_14 , \XY-CROSS_13 , \XY-CROSS_12 , \XY-CROSS_11 , \XY-CROSS_10 , \XY-CROSS_9 , \XY-CROSS_8 , \XY-CROSS_7 , \XY-CROSS_6 , \XY-CROSS_5 , \XY-CROSS_4 , \XY-CROSS_3 , \XY-CROSS_2 , \XY-CROSS_1 , \XY-CROSS_0 }),
    .XY({\XY-TARGET_19 , \XY-TARGET_18 , \XY-TARGET_17 , \XY-TARGET_16 , \XY-TARGET_15 , \XY-TARGET_14 , \XY-TARGET_13 , \XY-TARGET_12 , \XY-TARGET_11 , \XY-TARGET_10 , \XY-TARGET_9 , \XY-TARGET_8 , \XY-TARGET_7 , \XY-TARGET_6 , \XY-TARGET_5 , \XY-TARGET_4 , \XY-TARGET_3 , \XY-TARGET_2 , \XY-TARGET_1 , \XY-TARGET_0 }),
    .BUSY(HTPA_BUSY), .FIRE(FIRE), .VISIBLE(VISIBLE),
    .SW_OUT({\H-CROSSd , \XY-TARGETm , \H-CROSS , \H-BUSY , \XY-CROSSM , \FIRE-T }),
    .VSW_OUT({\XY-TARGETS , VBUSY}));  // open: CROSS, CROSSd
  DFF inst166 (.CLK(\clk-sdi ), .D(inst172_q), .Q(inst166_q));  // open: CLRN, PRN
  lpm_mux_2x18 inst2 (
    .data1x({\MASK1-DB , \OUT1-RAM [15:8], \MASK2-DB , \OUT2-RAM [15:8]}),
    .data0x({\MASK1-DA , \OUT1-RAM [7:0], \MASK2-DA , \OUT2-RAM [7:0]}), .sel(inst88_q), .result(inst2_result));
  LPM_ABS #(.LPM_WIDTH(9)) inst155 (.data(SUB_RAM), .result(SUB_DI_abs));  // open: overflow
  \HTPA-BLOB  inst76 (
    .CLK(CLK), .\non-ACTIVE (\HTPA-NON-ACTIVE ), .MASK(\HTPA-SCAN-MASK ), .X(\HTPA-SCAN-X ),
    .Y(\HTPA-SCAN-Y ), .Himp(\HTPA-SCAN-HSYNC ), .VBLANK(inst80_q), .\change-line (scan_hsync_htpa),
    .\ADR-READ-BLOB (\ADR-READ-BLOB ), .bbox_out_size(\BLOB-SIZE ), .bbox_compl(\HTPA-BLOB-complete ),
    .\BLOBS-out (\HTPA-BLOB-XY ));
  not inst89 (inst89_out, \scan-mode );
  DFF inst226 (.CLK(\clk-sdi ), .D(inst166_q), .Q(\MASK-3DFF ));  // open: CLRN, PRN
  lpm_decode0fdf inst198 (.data(\FRAME-WR ), .eq0(\RAM1-OEn ), .eq1(\RAM2-OEn ), .eq2(\RAM3-OEn ));
  lpm_mux_3x36 inst9 (
    .data2x({\RAM2-DA , \RAM2-DB , \RAM2-DATA , \RAM1-DA , \RAM1-DB , \RAM1-DATA }),
    .data1x({\RAM1-DA , \RAM1-DB , \RAM1-DATA , \RAM3-DA , \RAM3-DB , \RAM3-DATA }),
    .data0x({\RAM3-DA , \RAM3-DB , \RAM3-DATA , \RAM2-DA , \RAM2-DB , \RAM2-DATA }), .sel(\FRAME-WR ),
    .result({\MASK1-DA , \MASK1-DB , \OUT1-RAM , \MASK2-DA , \MASK2-DB , \OUT2-RAM }));
  lpm_mux_2x5 inst73 (.data1x(HTPA_TNUMBER), .data0x(\ADR-target ), .sel(inst52_out), .result(SWITCH));
  or inst52 (inst52_out, \HTPA_CPU-WORK , \sub-work );
  lpm_constant422 inst221 (.result(MULTY));
  DFF inst255 (.CLK(\clk-sdi ), .D(inst223_out), .Q(SUB255));  // open: CLRN, PRN
  assign {\Y-IR , \X-IR } = {\Y-HTPA , \X-HTPA };  // WIRE inst45
  and inst324 (\LOAD-XY , \LOAD-XY-T , inst89_out);
  DFF inst234[8:0] (.CLK(\clk-sdi ), .D(SUB_DI_abs), .Q(SUB_DI));  // open: CLRN, PRN
  DFF inst233[17:0] (
    .CLK(\clk-sdi ), .D(inst2_result), .Q({\MASK-A , \OUT-RAM-A , \MASK-B , \OUT-RAM-B }));  // open: CLRN, PRN
  DFF inst327[8:0] (.CLK(\clk-sdi ), .D({\MASK-A , \OUT-RAM-A }), .Q({Mvideo, Ivideo}));  // open: CLRN, PRN
  TRI inst146[7:0] (.IN(Ym), .OE(\RAM3-OEn ), .OUT(\RAM3-D [15:8]));
  TRI inst150 (.IN(MASK), .OE(\RAM3-OEn ), .OUT(\RAM3-DPB ));
  TRI inst149[7:0] (.IN(\Ym-DFF ), .OE(\RAM3-OEn ), .OUT(\RAM3-D [7:0]));
  TRI inst151 (.IN(\MASK-DFF ), .OE(\RAM3-OEn ), .OUT(\RAM3-DPA ));
  IMP inst443212 (.IN(ACTIVE), .CLK(\clk-sdi ), .OUT(Vsync));
  not inst186 (\nWR-FRAME [1], \RAM1-OEn );
  not inst188 (\nWR-FRAME [2], \RAM2-OEn );
  not inst189 (\nWR-FRAME [3], \RAM3-OEn );
  LINE_ADR inst231 (.X(\x-sdi ), .Y(\Y-SDI ), .MULT(MULTY), .\clk-sdi (\clk-sdi ), .\LINE-ADR (\LINE-ADR-WR ));
  DFF inst217[7:0] (.CLK(\clk-sdi ), .D(\RAM3-D [15:8]), .Q(\RAM3-DATA [15:8]));  // open: CLRN, PRN
  DFF inst216 (.CLK(\clk-sdi ), .D(\RAM3-DPB ), .Q(\RAM3-DB ));  // open: CLRN, PRN
  DFF inst215[7:0] (.CLK(\clk-sdi ), .D(\RAM3-D [7:0]), .Q(\RAM3-DATA [7:0]));  // open: CLRN, PRN
  DFF inst218 (.CLK(\clk-sdi ), .D(\RAM3-DPA ), .Q(\RAM3-DA ));  // open: CLRN, PRN
  SRFF inst67 (.CLRN(inst104_out), .S(\HTPA-FRAME-READY ), .R(GRESET), .CLK(CLK), .Q(GO));  // open: PRN
  not inst104 (inst104_out, GRESET);
  lpm_mux_2X20 inst228 (
    .data1x(\LINE-ADR-WR [20:1]), .data0x(\LINE-ADR-READ [20:1]), .sel(\RAM2-OEn ), .result(inst228_result));
  or inst46 (scan_hsync_htpa, \HTPA-FRAME-READY , scan_hsync_h);
  pll72 inst321 (.refclk(\clk-sdi ), .rst(1'b0), .outclk_0(\RAM1-CLK ));
  or inst92 (scan_htpa, SCAN_BLOB, \scan-sub-htpa );
  not inst36 (inst36_out, work);
  DFF inst47 (.CLK(CLK), .D(\HTPA-FRAME-READY ), .Q(inst47_q));  // open: CLRN, PRN
  lpm_mux_2X20 inst227 (
    .data1x(\LINE-ADR-WR [20:1]), .data0x(\LINE-ADR-READ [20:1]), .sel(\RAM1-OEn ), .result(inst227_result));
  lpm_mux_2X20 inst229 (
    .data1x(\LINE-ADR-WR [20:1]), .data0x(\LINE-ADR-READ [20:1]), .sel(\RAM3-OEn ), .result(inst229_result));
  HTPA_RAM_SCAN_stable inst53 (
    .clk(CLK), .START(inst47_q), .x(\adrX-blob ), .y(\adrY-blob ), .set(SCAN_BLOB), .hsync(scan_hsync_h),
    .non_active(non_active_htpa));
  HTPA_RAM_SCAN_2 inst69 (
    .clk(CLK), .START(\START-SUB-READ ), .window(\SUB-WINDOW ), .x(\Ax-HTPA ), .y(\AY-HTPA ),
    .set(\scan-sub-htpa ));
  lpm_mux_2X13 inst54 (
    .data1x({\AY-HTPA , \Ax-HTPA }), .data0x({\adrY-blob , \adrX-blob }), .sel(\sub-work ),
    .result({\adrY-htpa , \adrX-htpa }));
  or inst180 (\RAM1-BWAn , \nWR-FRAME [1], HBLANK);
  or inst183 (\RAM2-BWAn , \nWR-FRAME [2], HBLANK);
  or inst191 (\RAM3-BWAn , \nWR-FRAME [3], HBLANK);
  HTPA_MAIN_CAL inst17 (
    .CLK(CLK), .\CLK-SDI (\clk-sdi ), .HZ(\hz-imp ), .\X-HTPA (\X-IR ), .\Y-HTPA (\Y-IR ), .MISO(MISO),
    .NBUT(NBUT), .HSYNC(HSYNC), .\ADR-SCAN ({\adrY-htpa , \adrX-htpa }), .\SCAN-BLOB (SCAN_BLOB),
    .\SCAN-SUB (\scan-sub-htpa ), .RESETin(inst36_out), .\cal-save (\cal-save ), .\ust-save (\ust-save ),
    .\XO-HTPA ({{5{1'b0}}, \xo-htpa }), .\W-HTPA ({{5{1'b0}}, \W-HTPA }), .\YO-HTPA ({{5{1'b0}}, \H-HTPA }),
    .\H-HTPA ({6'b100000, THmax[9:0]}), .test(Robot_calibration), .SCLK(SCLK), .nEE(nEE_Enable), .MOSI(MOSI),
    .htpa_frame_ready(\HTPA-FRAME-READY ), .\OUT-RAM (\HTPA-OUT ), .\OUT-RAM-A (\HTPA-OUT-SCAN ),
    .\ptat-real (\PTAT-real ), .led(led_htpa), .XO_EEPROM(XO_EEPROM), .W_EEPROM(W_EEPROM),
    .YO_EEPROM(h_EEPROM), .H_EEPROM({EE_params, THmax_EEPROM}), .\write-cal (\WRITE-CAL ), .TFrame(TFrame),
    .GradScale(GradScale), .VddScGrad(VddScGrad), .VddScOff(VddScOff));
  DFF inst78[19:0] (.CLK(\clk-sdi ), .D(inst228_result), .Q(\RAM2-A ));  // open: CLRN, PRN
  TRI inst133[7:0] (.IN(Ym), .OE(\RAM1-OEn ), .OUT(\RAM1-D [15:8]));
  TRI inst139 (.IN(MASK), .OE(\RAM1-OEn ), .OUT(\RAM1-DPB ));
  TRI inst137[7:0] (.IN(\Ym-DFF ), .OE(\RAM1-OEn ), .OUT(\RAM1-D [7:0]));
  TRI inst142 (.IN(\MASK-DFF ), .OE(\RAM1-OEn ), .OUT(\RAM1-DPA ));
  TRI inst5956[7:0] (.IN(Ym), .OE(\RAM2-OEn ), .OUT(\RAM2-D [15:8]));
  TRI inst144 (.IN(MASK), .OE(\RAM2-OEn ), .OUT(\RAM2-DPB ));
  TRI inst143[7:0] (.IN(\Ym-DFF ), .OE(\RAM2-OEn ), .OUT(\RAM2-D [7:0]));
  TRI inst145 (.IN(\MASK-DFF ), .OE(\RAM2-OEn ), .OUT(\RAM2-DPA ));
  transparency inst161 (.result(inst161_result));
  DFF inst86[19:0] (.CLK(\clk-sdi ), .D(inst227_result), .Q(\RAM1-A ));  // open: CLRN, PRN
  DFF inst84[19:0] (.CLK(\clk-sdi ), .D(inst229_result), .Q(\RAM3-A ));  // open: CLRN, PRN
  DFF inst202[7:0] (.CLK(\clk-sdi ), .D(\RAM1-D [15:8]), .Q(\RAM1-DATA [15:8]));  // open: CLRN, PRN
  DFF inst204 (.CLK(\clk-sdi ), .D(\RAM1-DPB ), .Q(\RAM1-DB ));  // open: CLRN, PRN
  DFF inst205[7:0] (.CLK(\clk-sdi ), .D(\RAM1-D [7:0]), .Q(\RAM1-DATA [7:0]));  // open: CLRN, PRN
  DFF inst206 (.CLK(\clk-sdi ), .D(\RAM1-DPA ), .Q(\RAM1-DA ));  // open: CLRN, PRN
  DFF inst207[7:0] (.CLK(\clk-sdi ), .D(\RAM2-D [15:8]), .Q(\RAM2-DATA [15:8]));  // open: CLRN, PRN
  DFF inst208 (.CLK(\clk-sdi ), .D(\RAM2-DPB ), .Q(\RAM2-DB ));  // open: CLRN, PRN
  DFF inst213[7:0] (.CLK(\clk-sdi ), .D(\RAM2-D [7:0]), .Q(\RAM2-DATA [7:0]));  // open: CLRN, PRN
  DFF inst214 (.CLK(\clk-sdi ), .D(\RAM2-DPA ), .Q(\RAM2-DA ));  // open: CLRN, PRN
  Th_adaptive inst34 (.Tframe(TFrame), .Transpy(inst161_result), .Tvision(1'b0), .Threshold(Threshold));
  DFF inst27[6:0] (.CLK(CLK), .D(\adrX-htpa ), .Q(\adrx-htpa-t ));  // open: CLRN, PRN
  DFF inst31[5:0] (.CLK(CLK), .D(\adrY-htpa ), .Q(\adry-htpa-t ));  // open: CLRN, PRN
  DFF inst40[3:0] (
    .CLK(CLK), .D({\scan-sub-htpa , scan_htpa, scan_hsync_htpa, non_active_htpa}),
    .Q({\HTPA-sub-SCAN-t , \HTPA-SCAN-t , \HTPA-SCAN-HSYNC-t , \HTPA-NON-ACTIVE-t }));  // open: CLRN, PRN
  GLOBAL inst8 (.IN(CLKin), .OUT(CLK));
  not inst44 (inst44_out, \HTPA-NON-ACTIVE );
  lpm_constant4YYY inst96 (.result(YARKOST));
  lpm_constant4sdssqa inst94 (.result(blue));
  lpm_constant4DSDSYJ inst63 (.result(red));
  lpm_compare0eeeedfd inst136 (.dataa(\HTPA-OUT-SCAN ), .datab(Threshold), .ageb(\HTPA-MASK ));
  IMP inst329 (.IN(RX_H), .CLK(\clk-sdi ), .OUT(\Hsyn-sdi ));
  IMP inst317 (.IN(RX_v), .CLK(\clk-sdi ), .OUT(\Vsyn-sdi ));
  IMP inst22 (.IN(RX_H), .CLK(CLK), .OUT(HSYNC));
  IMP inst113 (.IN(RX_v), .CLK(CLK), .OUT(vsyn));
  not inst101 (inst101_out, sw_crcb);
  syncword_filter inst1314 (.in(\c-fon-T ), .out(htpa_to_sdi[9:0]));
  DFF inst29[6:0] (.CLRN(inst44_out), .CLK(CLK), .D(\adrx-htpa-t ), .Q(\HTPA-SCAN-X ));  // open: PRN
  DFF inst32[5:0] (.CLK(CLK), .D(\adry-htpa-t ), .Q(\HTPA-SCAN-Y ));  // open: CLRN, PRN
  DFF inst4442[3:0] (
    .CLK(CLK), .D({\HTPA-sub-SCAN-t , \HTPA-SCAN-t , \HTPA-SCAN-HSYNC-t , \HTPA-NON-ACTIVE-t }),
    .Q({durdom, \HTPA-SCAN , \HTPA-SCAN-HSYNC , \HTPA-NON-ACTIVE }));  // open: CLRN, PRN
  syncword_filter inst130 (.in(\y-fon ), .out(htpa_to_sdi[19:10]));
  lpm_mux_2x1 inst100 (.data1(inst101_out), .data0(sw_crcb), .sel(\DRAW-FIRE ), .result(inst100_result));
  more1023 inst102 (.DATA_READ(\HTPA-OUT ), .subred(subred), .blue(blue), .Y(inst102_y), .CB(cb), .CR(cr));
  HTPA_coords inst20 (
    .\clk-sdi (\clk-sdi ), .\x-sdi (\x-sdi ), .\y-sdi (\Y-SDI ), .\XO-HTPA (\xo-htpa ),
    .\YO-HTPA (\yo-htpa ), .\W-HTPA (\W-HTPA ), .\H-HTPA (\H-HTPA ), .\X-HTPA (\X-HTPA ),
    .\y-HTPA (\Y-HTPA ), .\WINDOW-HTPA (\WINDOW-HTPA ));
  lpm_mux_2X10 inst2667 (.data1x(blue), .data0x(red), .sel(inst100_result), .result(CVET));
  DFF inst58 (.CLK(CLK), .D(\REWRITE-SUB-RAM ), .Q(inst58_q));  // open: CLRN, PRN
  lpm_mux_2X13 inst55 (
    .data1x({\adry-htpa-t , \adrx-htpa-t }), .data0x({\AY-HTPA , \Ax-HTPA }), .sel(inst58_q),
    .result(\adr-dT ));
  DFF inst24 (.CLK(CLK), .D(\HTPA-MASK ), .Q(\HTPA-SCAN-MASK ));  // open: CLRN, PRN
  lpm_add_sub0DAAJ inst59 (.dataa({1'b0, \HTPA-PIXEL-OLD }), .datab({1'b0, \HTPA-OUT-SCAN }), .result(inst59_result));
  lpm_compare0ugg inst119 (.dataa(\HTPA-PIXEL-OLD ), .ageb(inst119_ageb));
  lpm_compare0ugg inst120 (.dataa(\HTPA-OUT-SCAN ), .ageb(inst120_ageb));
  lpm_comparehfgd0 inst122 (.dataa(SUB_DI_HTPA[9:0]), .aeb(inst122_aeb));
  lpm_constant4hgfxd inst109 (.result(inst109_result));
  not inst57 (inst57_out, \scan-sub-htpa );
  RAM_SIMPLE inst49 (
    .data({\HTPA-MASK , \HTPA-OUT-SCAN }), .wren(inst58_q), .address(\adr-dT ), .clock(CLK),
    .q({\HTPA-MASK-OLD , \HTPA-PIXEL-OLD }));
  sdiii inst164 (
    .rx_coreclk_is_ntsc_paln(1'b0), .rx_rst(1'b0), .rx_coreclk_hd(clk_148_p), .xcvr_refclk(clk_148_p),
    .sdi_rx(sdi_rx_p), .rx_dataout(data_sdi), .rx_dataout_valid(rx_valid), .rx_v(RX_v), .rx_h(RX_H),
    .rx_ap(rx_ap), .rx_trs(rx_trs), .rx_ln(\YY-SDI ), .rx_clkout(inst164_rx_clkout));  // open: reconfig_to_xcvr, rx_f, rx_format, rx_eav, rx_align_locked, rx_trs_locked, rx_frame_locked, rx_rst_proto_out, rx_clkout_is_ntsc_paln, rx_pll_locked, reconfig_from_xcvr
  lpm_mux_2X10 inst212 (.data1x(cr), .data0x(cb), .sel(sw_crcb), .result(\c-fon-T ));
  nand inst118 (sub_1023, inst119_ageb, inst120_ageb, inst122_aeb);
  and inst170 (inst170_out, \show-blue , \box-draw );
  DFF inst65[9:0] (.CLK(\clk-sdi ), .D(inst102_y), .Q(\y-fon ));  // open: CLRN, PRN
  lpm_counter15j inst1 (.clock(CLK), .clk_en(vsyn), .aclr(1'b0), .cout(HZ), .q(cnt_v));
  lpm_constant4dfhbg inst193 (.result(inst193_result));
  IMP inst56 (.IN(inst57_out), .CLK(CLK), .OUT(inst56_out));
  or inst61 (\HTPA-MASK-ALL , \HTPA-MASK-OLD , \HTPA-MASK );
  LPM_ABS #(.LPM_WIDTH(11)) inst115 (.data(inst59_result), .result(SUB_DI_HTPA));  // open: overflow
  lpm_constant4sxxz inst176 (.result(inst176_result));
  lpm_mux8HF inst334 (.data1x({YARKOST, \CVET-red }), .data0x(inst109_result), .sel(\WRITE-CAL ), .result(Th511_all));
  lpm_mux_2x20 inst210 (.data1x({YARKOST, CVET}), .data0x(htpa_to_sdi), .sel(HTPA_BLOB_DRAW), .result(inst210_result));
  or inst168 (inst168_out, inst170_out, \DRAW-FIRE );
  and inst318 (inst318_out, HTPA_BLOB_DRAW, inst168_out);
  assign {V_S, V_divady, V_cross, Vdivmovech, V_THFIRE, V_SummaAll, V_SUBF, V_SUBC, V_vSUBF, V_vSUBC, V_Tmax, V_TAdyo, V_syncdx, V_syncdy, V_YOChange, V_YOMove, vi} = debug_out;  // WIRE inst26
  HTPA_DRAW_sv #(.WIDTH(5'b10011)) inst10 (
    .X(\X-HTPA ), .Y(\Y-HTPA ), .busy(VISIBLE),
    .IN({\XY-CROSS_19 , \XY-CROSS_18 , \XY-CROSS_17 , \XY-CROSS_16 , \XY-CROSS_15 , \XY-CROSS_14 , \XY-CROSS_13 , \XY-CROSS_12 , \XY-CROSS_11 , \XY-CROSS_10 , \XY-CROSS_9 , \XY-CROSS_8 , \XY-CROSS_7 , \XY-CROSS_6 , \XY-CROSS_5 , \XY-CROSS_4 , \XY-CROSS_3 , \XY-CROSS_2 , \XY-CROSS_1 , \XY-CROSS_0 }),
    .firein(FIRE), .draw(draw), .fire_draw(fdraw), .box_draw(bdraw), .fire(falarm));
  and inst60 (inst60_out, GO, \cross-end );
  not inst4 (LED[1], cnt_v[3]);
  lpm_mux0 inst230 (.data1(inst318_out), .data0(inst168_out), .sel(rect_only), .result(inst230_result));
  DFF inst338 (.CLK(\clk-sdi ), .D(draw), .Q(HTPA_BLOB_DRAW));  // open: CLRN, PRN
  DFF inst337 (.CLK(\clk-sdi ), .D(fdraw), .Q(\DRAW-FIRE ));  // open: CLRN, PRN
  DFF inst335 (.CLK(\clk-sdi ), .D(bdraw), .Q(\box-draw ));  // open: CLRN, PRN
  not inst41 (LED[0], 1'b0);
  not inst87 (LED[2], DSW[0]);
  DFF inst1293[19:0] (.CLK(\clk-sdi ), .D(inst210_result), .Q(inst1293_q));  // open: CLRN, PRN
  GLOBAL inst75 (.IN(inst164_rx_clkout), .OUT(\clk-sdi ));
  HTPA_CPU_new inst14 (
    .CLK(CLK), .START(inst60_out), .INPUT_BUS({\H-CROSSd , \H-CROSS , \H-BUSY , \XY-CROSSM }),
    .\GL-RESET (1'b0), .\XY-TARGET (\XY-TARGETm ), .\EN-CPU (HTPA_EN_CPU), .\END-SUB-READ (inst56_out),
    .\MASK-HTPA (\HTPA-MASK-ALL ), .\DELTA-HTPA (SUB_DI_HTPA[9:0]),
    .\ADR-PIXEL-HTPA ({\adry-htpa-t , \adrx-htpa-t }), .\EN-PIXEL-HTPA (\HTPA-sub-SCAN-t ),
    .\fire-in (\FIRE-T ), .sub_1023(sub_1023), .\CLK-SDI (\clk-sdi ), .\START-READ-SRAM (VIMP),
    .\XY-IN (\XY-TARGETS ), .VBUSY(VBUSY), .DELTA(SUB_DI[7:0]), .MASK(\MASK-RAM ), .SUB255(SUB255),
    .WDIV(WDIV[4:0]), .HDIV(HDIV[4:0]), .\XO-HTPA (\xo-htpa ), .\YO-HTPA (\yo-htpa ), .Tpix(\HTPA-OUT-SCAN ),
    .DEMO(DSW[0]), .Ivideo(Ivideo), .YMEAN(YMEAN), .THmax(THmax[9:0]), .XY(HTPA_CPU_XY),
    .\SAVE-XY (\CPU-WR-XY ), .\CPU-WORK (\HTPA_CPU-WORK ), .FIRE(\FIRE-CPU ), .NUMBER(HTPA_TNUMBER),
    .\START-SUB-READ (\START-SUB-READ ), .\SUB-WINDOW (\SUB-WINDOW ), .SUB_WORK(\sub-work ),
    .\Rw-RAM (\REWRITE-SUB-RAM ), .\X-SDI-READ (\X-SDI-READ ), .\Y-SDI-READ (\Y-SDI-READ ),
    .debug_out(debug_out), .\SRAM-READ (\SRAM-READ ), .VNUMBER(\VADR-target ), .VSUBF(VSUBF), .VSUBC(VSUBC),
    .visible(\VISIBLE-CPU ));
  DFF inst1297 (.CLK(\clk-sdi ), .D(inst230_result), .Q(inst1297_q));  // open: CLRN, PRN
  lpm_mux8HF inst331 (.data1x(inst176_result), .data0x(border), .sel(sw_cifra), .result(inst331_result));
  lpm_mux_4x20 inst165 (
    .data15x(inst176_result), .data14x(Th511_all), .data13x({YARKOST, \CVET-red }),
    .data12x({YARKOST, \CVET-red }), .data11x({10'b1100000000, \CVET-yellow }), .data10x(Th511_all),
    .data9x({YARKOST, \CVET-red }), .data8x(inst193_result), .data7x(inst193_result), .data6x(Th511_all),
    .data5x({YARKOST, \CVET-red }), .data4x({YARKOST, \CVET-red }), .data3x(Th511_all), .data2x(Th511_all),
    .data1x(Th511_all), .data0x(Th511_all), .sel(\draw-pic-fire ), .result(border));
  DFF inst1294[19:0] (.CLK(\clk-sdi ), .D(htpa_to_sdi), .Q(inst1294_q));  // open: CLRN, PRN
  lpm_mux8HF inst289 (.data1x(inst1293_q), .data0x(\data-sdi-t ), .sel(inst1297_q), .result(inst289_result));
  DFF inst39[13:0] (.CLK(\clk-sdi ), .D({rx_trs, rx_ap, rx_valid, \YY-SDI }), .Q(inst39_q));  // open: CLRN, PRN
  DFF inst97 (.CLK(CLK), .D(fire_was_detected), .Q(inst97_q));  // open: CLRN, PRN
  DFF inst37[13:0] (.CLK(\clk-sdi ), .D(inst39_q), .Q(inst37_q));  // open: CLRN, PRN
  IMP inst342 (.IN(hour), .CLK(CLK), .OUT(inst342_out));
  Y_CORR inst25 (.YY(\YY-SDI ), .clk(\clk-sdi ), .Y(\Y-SDI ), .nACTIVE(nACTIVE), .active_y(y_mask_en), .Y_1065(Y_1065));
  lpm_mux8HF inst315 (.data1x(inst1294_q), .data0x(inst289_result), .sel(Tvision), .result(inst315_result));
  or inst110 (inst110_out, inst97_q, gstart);
  DFF inst38[13:0] (.CLK(\clk-sdi ), .D(inst37_q), .Q({rx_trs_t, rx_ap_t, rx_valid_t, RX_LN}));  // open: CLRN, PRN
  IMP inst328 (.IN(HZ), .CLK(\clk-sdi ), .OUT(\hz-imp-sdi ));
  lpm_counter15fg inst127767 (.sclr(RX_H), .clock(\clk-sdi ), .q(sw_crcb));  // open: cout
  IMP inst23 (.IN(ACTIVE), .CLK(CLK), .OUT(\start-htpa-analyse ));
  onstant0 inst187 (.result(inst187_result));
  IMP inst93 (.IN(falarm), .CLK(CLK), .OUT(inst93_out));
  counter_X inst43 (.sclr(RX_H), .clock(\clk-sdi ), .q(\x-sdi ));
  lpm_mux8HF inst246 (.data1x(inst315_result), .data0x(inst331_result), .sel(\WINDOW-HTPA ), .result(inst246_result));
  DFF inst50[19:0] (.CLK(\clk-sdi ), .D(data_sdi), .Q(inst50_q));  // open: CLRN, PRN
  DFF inst51[19:0] (.CLK(\clk-sdi ), .D(inst50_q), .Q(\data-sdi-t ));  // open: CLRN, PRN
  SRFF inst85 (.S(inst93_out), .R(inst110_out), .CLK(CLK), .Q(fire_was_detected));  // open: PRN, CLRN
  lpm_counter2 inst121 (.clock(CLK), .clk_en(vsyn), .cout(hour), .q(hz_cnt));
  lpm_counter4 inst138 (.clock(CLK), .clk_en(inst342_out), .q(FD_life));
  IMP inst174 (.IN(HZ), .CLK(CLK), .OUT(\hz-imp ));
  not inst30 (ACTIVE, nACTIVE);
  DFF inst33[19:0] (.CLK(\clk-sdi ), .D(\data-sdi-t ), .Q(inst33_q));  // open: CLRN, PRN
  IMP inst11 (.IN(cnt_v[3]), .CLK(CLK), .OUT(inst11_out));
  IMP inst72 (.IN(nACTIVE), .CLK(\clk-sdi ), .OUT(VIMP));
  DFF inst128[19:0] (.CLK(\clk-sdi ), .D(inst246_result), .Q(inst128_q));  // open: CLRN, PRN
  lpm_mux_2x20 inst240 (.data1x(inst128_q), .data0x(inst187_result), .sel(ACTIVE), .result(inst240_result));
  Draw_cifra inst12 (
    .clk(\clk-sdi ), .Y(\Y-SDI ), .PTAT({{5{1'b0}}, \PTAT-real }), .YMEAN({{5{1'b0}}, YMEAN}), .S(V_S),
    .divady(V_divady), .thfire({{6{1'b0}}, V_THFIRE}), .summaall(V_SummaAll), .subf({3'b000, V_SUBF}),
    .subc({3'b000, V_SUBC}), .vsubf({2'b00, V_vSUBF}), .vsubc({2'b00, V_vSUBC}), .tmax({3'b000, V_Tmax}),
    .adyo(V_TAdyo), .yochange({{6{1'b0}}, V_YOChange}), .yomove({{6{1'b0}}, V_YOMove}), .syncdy(V_syncdy),
    .syncdx(V_syncdx), .VI({2'b00, vi}), .TFrame({3'b000, TFrame}), .THmax({3'b000, THmax[9:0]}),
    .FireAlarm_cnt({{6{1'b0}}, FireAlarm_cnt[7:1]}), .FD_life(FD_life), .cifra(inst12_cifra),
    .znak(inst12_znak), .YO(inst12_yo));
  or inst74 (HBLANK, nACTIVE, RX_H);
  or inst103 (inst103_out, falarm, \bad-focus );
  not inst28 (inst28_out, rx_trs_t);
  and inst79 (inst79_out, rx_ap_t, inst28_out);
  and inst192 (\en-fire-bmp , cnt_v[3], inst103_out);
  lpm_mux_2x20 inst241 (.data1x(inst240_result), .data0x(inst33_q), .sel(inst79_out), .result(\DATA-TO-FIFO ));
  lpm_counter1 inst91 (.clk_en(fire_was_detected), .clock(CLK), .cnt_en(~fal_cout), .cout(fal_cout), .q(FireAlarm_cnt));
  not inst311 (inst311_out, GRESET);
  fifa inst3 (
    .data(\DATA-TO-FIFO ), .wrreq(1'b1), .wrclk(\clk-sdi ), .rdreq(1'b1), .rdclk(tx_clk), .aclr(inst11_out),
    .q(tx_data));  // open: wrfull, wrempty, wrusedw, rdfull, rdempty, rdusedw
  lpm_constant80 inst112 (.result(inst112_result));
  lpm_constant4cxfg inst181 (.result(inst181_result));
  lpm_compare2 inst135 (.dataa(hz_cnt), .aeb(\TEN-SEC ));
  SRFF inst171 (.CLRN(inst311_out), .S(\hz-imp ), .R(GRESET), .CLK(CLK), .Q(work));  // open: PRN
  sdias inst (
    .tx_rst(1'b0), .tx_enable_crc(1'b0), .tx_enable_ln(1'b0), .tx_datain(tx_data), .tx_datain_valid(1'b1),
    .tx_pclk(tx_clk), .tx_coreclk_hd(clk_148_p), .xcvr_refclk(clk_148_p), .tx_dataout_valid(SDI_EN),
    .sdi_tx(sdi_tx_p), .tx_clkout(tx_clk));  // open: tx_ln, tx_trs, reconfig_to_xcvr, tx_pll_locked, reconfig_from_xcvr
  Draw_numbers inst62 (
    .clk(\clk-sdi ), .\x-sdi (\x-sdi ), .\y-sdi (\Y-SDI ), .cifra(inst12_cifra), .znak(inst12_znak),
    .Yposition(inst12_yo), .sw_cifra(sw_cifra));
  Draw_alarm inst190 (
    .\x-sdi (\x-sdi ), .\y-sdi (\Y-SDI ), .\clk-sdi (\clk-sdi ), .en(\en-fire-bmp ), .fire_alarm(falarm),
    .\draw-pic-fire (\draw-pic-fire ));
  IMP inst90 (.IN(work), .CLK(CLK), .OUT(gstart));
  lpm_divideR_80 inst111 (.numer(\W-HTPA ), .denom(inst112_result), .quotient(WDIV));  // open: remain
  lpm_mux_2X10 inst211 (.data1x(red), .data0x(blue), .sel(sw_crcb), .result(inst211_result));
  lpm_mux_2X10 inst209 (.data1x(inst181_result), .data0x(blue), .sel(sw_crcb), .result(yellow));
  lpm_constant0dtgf inst35 (.result(\H-HTPA ));
  assign HDIV = {{6{1'b0}}, \H-HTPA [10:6]};  // WIRE inst15
  DFF inst169[9:0] (.CLK(\clk-sdi ), .D(inst211_result), .Q(\CVET-red ));  // open: CLRN, PRN
  DFF inst177[9:0] (.CLK(\clk-sdi ), .D(yellow), .Q(\CVET-yellow ));  // open: CLRN, PRN
  lpm_counter4dssaa inst273 (.clock(RX_H), .q(rx_cnt));
  or inst298 (inst298_out, \wr-atmel [8], \wr-atmel [9]);
  or inst305 (inst305_out, \wr-atmel [12], \wr-atmel [13]);
  assign \yo-htpa  = {11{1'b0}};  // WIRE inst21
  and inst274 (\led-atm , \ATM-ADR [0], \fire-alarm );
  DFF inst107[26:0] (.CLK(CLK), .D({\XY-TARGETm , 1'b1}), .Q(inst107_q));  // open: CLRN, PRN
  SRFF inst182 (.S(\TEN-SEC ), .R(GRESET), .CLK(CLK), .Q(\ATMELIN-EN ));  // open: PRN, CLRN
  DFF inst257[26:0] (.CLK(CLK), .D(inst107_q), .Q(inst257_q));  // open: CLRN, PRN
  and inst299 (\x-en , \atm-imp , inst298_out);
  and inst306 (\y-en , \atm-imp , inst305_out);
  lpm_compare1 inst70 (.dataa(\H-HTPA ), .datab(h_EEPROM[10:0]), .aeb(ustirovan));
  not inst132 (inst132_out, \HTPA-BLOB-complete );
  CHOISE inst258 (.LUT_INDEX(\ATM-ADR [4:0]), .DATA(mux_target));
  udecoder inst48 (.dec_in(\ATM-ADR [4:0]), .dec_out(\osd-en ));
  DFF inst292 (.CLRN(\ATMELIN-EN ), .CLK(CLK), .D(ATM_WIRE), .Q(inst292_q));  // open: PRN
  lpm_decode0TRFDS inst106 (
    .data(\FIRE-NUMBER ), .eq1(inst106_eq1), .eq2(inst106_eq2), .eq3(inst106_eq3), .eq4(inst106_eq4));
  lpm_add_sub0dfdas inst297 (
    .add_sub(\wr-atmel [9]), .dataa(\xo-htpa ), .clken(\x-en ), .clock(CLK), .result(inst297_result));
  lpm_add_sub0dfdas inst300 (
    .add_sub(\wr-atmel [13]), .dataa(\W-HTPA ), .clken(\y-en ), .clock(CLK), .result(inst300_result));
  DFFE inst124[26:0] (.CLRN(inst132_out), .D(inst257_q), .CLK(CLK), .ENA(\EN-FIREXY [1]), .Q(inst124_q));  // open: PRN
  DFFE inst154[26:0] (.CLRN(inst132_out), .D(inst257_q), .CLK(CLK), .ENA(\EN-FIREXY [2]), .Q(inst154_q));  // open: PRN
  DFFE inst162[26:0] (.CLRN(inst132_out), .D(inst257_q), .CLK(CLK), .ENA(\EN-FIREXY [3]), .Q(inst162_q));  // open: PRN
  DFFE inst163[26:0] (.CLRN(inst132_out), .D(inst257_q), .CLK(CLK), .ENA(\EN-FIREXY [4]), .Q(inst163_q));  // open: PRN
  IMP inst262 (.IN(inst292_q), .CLK(CLK), .OUT(\atm-takt ));
  lpm_counter2jujh inst260 (.clock(rx_cnt[5]), .q(sw_byte));
  DFF inst196 (.CLK(CLK), .D(rx_cnt[5]), .Q(inst196_q));  // open: CLRN, PRN
  SRFF inst302 (.S(\x-en ), .R(\ust-default ), .CLK(CLK), .Q(inst302_q));  // open: PRN, CLRN
  DFFE inst277[26:0] (
    .D(inst124_q), .CLK(CLK), .ENA(\en-fire-coords ), .Q({\DATA-ONE , \ATM-FIREA [1]}));  // open: PRN, CLRN
  DFFE inst278[26:0] (
    .D(inst154_q), .CLK(CLK), .ENA(\en-fire-coords ), .Q({\DATA-TWO , \ATM-FIREA [2]}));  // open: PRN, CLRN
  DFFE inst279[26:0] (
    .D(inst162_q), .CLK(CLK), .ENA(\en-fire-coords ), .Q({\DATA-THREE , \ATM-FIREA [3]}));  // open: PRN, CLRN
  DFFE inst280[26:0] (
    .D(inst163_q), .CLK(CLK), .ENA(\en-fire-coords ), .Q({\DATA-FOUR , \ATM-FIREA [4]}));  // open: PRN, CLRN
  lpm_mux_5X26 inst175 (
    .data4x(\DATA-FOUR ), .data3x(\DATA-THREE ), .data2x(\DATA-TWO ), .data1x(\DATA-ONE ),
    .data0x({26{1'b0}}), .sel(mux_target), .result(inst175_result));
  IMP inst108 (.IN(inst106_eq1), .CLK(CLK), .OUT(\EN-FIREXY [1]));
  IMP inst179 (.IN(inst106_eq2), .CLK(CLK), .OUT(\EN-FIREXY [2]));
  IMP inst245 (.IN(inst106_eq3), .CLK(CLK), .OUT(\EN-FIREXY [3]));
  IMP inst256 (.IN(inst106_eq4), .CLK(CLK), .OUT(\EN-FIREXY [4]));
  lpm_mux_2x1111 inst301 (.data1x(inst297_result), .data0x(XO_EEPROM[10:0]), .sel(inst302_q), .result(inst301_result));
  lpm_mux_2x1111 inst307 (.data1x(inst300_result), .data0x(W_EEPROM[10:0]), .sel(inst309_q), .result(inst307_result));
  SRFF inst309 (.S(\y-en ), .R(\ust-default ), .CLK(CLK), .Q(inst309_q));  // open: PRN, CLRN
  lpare0 inst18 (.dataa(\x-sdi ), .ageb(inst18_ageb));
  DFF inst242 (.CLK(CLK), .D(inst196_q), .Q(inst242_q));  // open: CLRN, PRN
  cpm_counter0 inst259 (.clock(sw_byte), .q(\ATM-ADR [4:0]));  // open: cout
  not inst129 (inst129_out, \nACTIVE-VIDEO );
  csc4 inst235 (.y(Y), .cb(v_cb), .cr(V_cr), .r(R), .g(GR), .b(B));
  lpm_mux_2X8 inst105 (.data1x(FIRE_COORDS[15:8]), .data0x(FIRE_COORDS[7:0]), .sel(sw_byte), .result(\ATM-DATA [8:1]));
  DFF inst243 (.CLK(CLK), .D(inst242_q), .Q(inst243_q));  // open: CLRN, PRN
  lpm_constant_xoo inst114 (.result(\x-ust ));
  or inst319 (inst319_out, \wr-atmel [1], \wr-atmel [2]);
  or inst116 (\nACTIVE-VIDEO , \NON-ACTIVE , nACTIVE);
  DFF inst261 (.CLK(CLK), .D(inst243_q), .Q(inst261_q));  // open: CLRN, PRN
  DFF inst286 (.CLK(CLK), .D(\atm-takt ), .Q(\atm-imp ));  // open: CLRN, PRN
  or inst160 (\NOT-ACTIVE , inst18_ageb, RX_H);
  and inst5 (inst5_out, inst129_out, \WINDOW-HTPA );
  assign \ATM-ADR [5] = sw_byte;  // WIRE inst157
  DFF inst275 (.CLK(CLK), .D(inst261_q), .Q(inst275_q));  // open: CLRN, PRN
  DFF inst304[10:0] (.CLK(CLK), .D(inst301_result), .Q(inst304_q));  // open: CLRN, PRN
  DFF inst310[10:0] (.CLK(CLK), .D(inst307_result), .Q(inst310_q));  // open: CLRN, PRN
  lpm_constant0yhsdrtgctf inst288 (.result(inst288_result));
  lpm_compare_220 inst250 (.dataa(Y), .agb(inst250_agb));
  lpm_compare_7ageb inst251 (.dataa(R), .datab(B), .ageb(inst251_ageb));
  IMP inst265 (.IN(sw_byte), .CLK(CLK), .OUT(swb));
  and inst320 (inst320_out, \atm-imp , inst319_out);
  not inst66 (inst66_out, sw_crcb);
  DFF inst197[7:0] (.CLK(\clk-sdi ), .D(Y), .Q(inst197_q));  // open: CLRN, PRN
  DFF inst276 (.CLK(CLK), .D(inst275_q), .Q(inst276_q));  // open: CLRN, PRN
  lpm_compare_5_0 inst42 (.dataa(\ATM-ADR [4:0]), .aeb(inst42_aeb));
  TYCO_COORDS_htpa inst178 (.XY(inst175_result), .distortion_en(dist_en), .Xc(XC), .Yc(YC), .SX(SX), .SY(SY));
  summabit #(.WIDTH(14)) inst282 (.DATA(VISIBLE[14:0]), .summa(\PRE-alarm ));
  DFFE inst263[19:0] (.D(\osd-en [20:1]), .CLK(CLK), .ENA(\atm-takt ), .Q(\wr-atmel [20:1]));  // open: PRN, CLRN
  SRFF inst127 (.S(\ust-save-imp ), .R(\ust-save ), .CLK(CLK), .Q(inst127_q));  // open: PRN, CLRN
  SRFF inst134 (.S(\cal-save-imp ), .R(\cal-save ), .CLK(CLK), .Q(inst134_q));  // open: PRN, CLRN
  or inst294 (inst294_out, ustirovan, inst302_q);
  or inst293 (inst293_out, ustirovan, inst309_q);
  DFF inst287 (.CLK(\clk-sdi ), .D(\NOT-ACTIVE ), .Q(\NON-ACTIVE ));  // open: CLRN, PRN
  DFF inst99[7:0] (.CLK(\clk-sdi ), .D(R), .Q(Rt));  // open: CLRN, PRN
  DFF inst117[7:0] (.CLK(\clk-sdi ), .D(GR), .Q(GRt));  // open: CLRN, PRN
  DFF inst236[7:0] (.CLK(\clk-sdi ), .D(B), .Q(Bt));  // open: CLRN, PRN
  DFF inst283 (.CLK(CLK), .D(inst276_q), .Q(inst283_q));  // open: CLRN, PRN
  or inst272 (\fire-alarm , \ATM-FIREA [1], \ATM-FIREA [2], \ATM-FIREA [3], \ATM-FIREA [4]);
  lpm_mux_2x1111 inst295 (.data1x(inst304_q), .data0x(\x-ust ), .sel(inst294_out), .result(\xo-htpa ));
  lpm_mux_2x1111 inst303 (.data1x(inst310_q), .data0x(inst288_result), .sel(inst293_out), .result(\W-HTPA ));
  lpm_add_sub3 inst82 (
    .add_sub(\wr-atmel [2]), .dataa(THmax), .clken(inst320_out), .clock(CLK), .result(inst82_result));
  Ymean_Focus inst13 (
    .Y(Y), .CLK(\clk-sdi ), .WINDOW(inst5_out), .RX_V(\Vsyn-sdi ), .\hz-imp (\hz-imp-sdi ), .W(\W-HTPA ),
    .H(\H-HTPA ), .Ymean(YMEAN), .white_on(white_on), .focus_bad(\bad-focus ));
  DFF inst237[7:0] (.CLK(\clk-sdi ), .D(inst197_q), .Q(inst237_q));  // open: CLRN, PRN
  and inst248 (inst248_out, inst250_agb, inst251_ageb);
  DFF inst284 (.CLK(CLK), .D(inst283_q), .Q(\ATM-DATA [0]));  // open: CLRN, PRN
  and inst131 (\ust-save , \HTPA-FRAME-READY , inst127_q);
  and inst203 (\cal-save , \HTPA-FRAME-READY , inst134_q);
  DFFE inst64[7:0] (.D(data_sdi[9:2]), .CLK(\clk-sdi ), .ENA(sw_crcb), .Q(V_cr));  // open: PRN, CLRN
  DFFE inst68[7:0] (.D(data_sdi[9:2]), .CLK(\clk-sdi ), .ENA(inst66_out), .Q(v_cb));  // open: PRN, CLRN
  DFF stp_i[7:0] (.CLK(\clk-sdi ), .D(data_sdi[19:12]), .Q(Y));  // open: CLRN, PRN
  DFF inst238[7:0] (.CLK(\clk-sdi ), .D(inst237_q), .Q(Ym));  // open: CLRN, PRN
  Full inst125 (.R(Rt), .G(GRt), .B(Bt), .Full(color));
  DFF inst247 (.CLK(\clk-sdi ), .D(inst248_out), .Q(inst247_q));  // open: CLRN, PRN
  IMP inst281 (.IN(inst42_aeb), .CLK(CLK), .OUT(\en-fire-coords ));
  SRFF inst330 (.S(inst320_out), .R(\ust-default ), .CLK(CLK), .Q(inst330_q));  // open: PRN, CLRN
  DFF inst252 (.CLK(\clk-sdi ), .D(inst247_q), .Q(mask_white));  // open: CLRN, PRN
  lpm_mux_2x1111 inst325 (
    .data1x(inst82_result), .data0x({1'b0, THmax_EEPROM}), .sel(inst330_q), .result(inst325_result));
  DFF inst126 (.CLK(\clk-sdi ), .D(color), .Q(mask_color));  // open: CLRN, PRN
  lpm_constant1 inst16 (.result(inst16_result));
  and inst266 (THmax_plus, \atm-imp , \wr-atmel [1]);
  and inst267 (THmax_minus, \atm-imp , \wr-atmel [2]);
  and inst268 (inst268_out, \atm-imp , \wr-atmel [3]);
  and inst269 (inst269_out, \atm-imp , \wr-atmel [4]);
  and inst270 (inst270_out, \atm-imp , \wr-atmel [5]);
  and inst291 (\ust-default , \atm-imp , \wr-atmel [6]);
  and inst290 (\ust-save-imp , \atm-imp , \wr-atmel [7]);
  and inst296 (\cal-save-imp , \atm-imp , \wr-atmel [16]);
  and inst312 (Tvision_sw, \atm-imp , \wr-atmel [17]);
  and inst313 (inst313_out, \atm-imp , \wr-atmel [18]);
  and inst314 (inst314_out, \atm-imp , \wr-atmel [19]);
  and inst322 (inst322_out, \atm-imp , \wr-atmel [20]);
  and inst323 (inst323_out, \atm-imp , \wr-atmel [21]);
  and inst326 (inst326_out, \atm-imp , \wr-atmel [11]);
  DFF inst332[10:0] (.CLK(CLK), .D(inst325_result), .Q(inst332_q));  // open: CLRN, PRN
  or inst249 (inst249_out, mask_color, mask_white);
  lpm_mux0dfdas inst244 (
    .data21x({SX, SY}), .data20x({XC, YC}), .data19x({{13{1'b0}}, \ATM-FIREA [4], 2'b01}),
    .data18x({SX, SY}), .data17x({XC, YC}), .data16x({{13{1'b0}}, \ATM-FIREA [3], 2'b01}),
    .data15x({SX, SY}), .data14x({XC, YC}), .data13x({{13{1'b0}}, \ATM-FIREA [2], 2'b01}),
    .data12x({SX, SY}), .data11x({XC, YC}), .data10x({{13{1'b0}}, \ATM-FIREA [1], 2'b01}),
    .data9x({{6{1'b0}}, THmax[9:0]}),
    .data8x({2'b00, \fire-alarm , \PRE-alarm , \scan-mode , 2'b00, \bad-focus , 4'b0000, dist_en, Tvision, trect, \show-blue }),
    .data7x({{6{1'b0}}, THmax[9:0]}), .data6x({{6{1'b0}}, THmax[9:0]}), .data5x({{6{1'b0}}, THmax[9:0]}),
    .data4x({{6{1'b0}}, THmax[9:0]}), .data3x({{6{1'b0}}, THmax[9:0]}), .data2x({{6{1'b0}}, THmax[9:0]}),
    .data1x({{6{1'b0}}, THmax[9:0]}), .data0x({{6{1'b0}}, THmax[9:0]}), .sel(\ATM-ADR [4:0]),
    .result(FIRE_COORDS));
  or inst333 (inst333_out, ustirovan, inst330_q);
  DFF inst253 (.CLK(\clk-sdi ), .D(inst249_out), .Q(MASK));  // open: CLRN, PRN
  lpm_mux_2x1111 inst339 (.data1x(inst332_q), .data0x(inst16_result), .sel(inst333_out), .result(THmax));
  lpm_counter0 inst1306 (.clock(CLK), .clk_en(Tvision_sw), .q(Tvision));
  lpm_counter0 inst1307 (.clock(CLK), .clk_en(inst313_out), .q(trect));
  lpm_counter0 inst1308 (.clock(CLK), .clk_en(inst314_out), .q(inst1308_q));
  lpm_counter0 inst1309 (.clock(CLK), .clk_en(inst322_out), .q(\scan-mode ));
  lpm_counter0 inst1312 (.clock(CLK), .clk_en(inst323_out), .q(inst1312_q));
  lpm_counter0 inst1313 (.clock(CLK), .clk_en(inst326_out), .q(Robot_calibration));
  lpm_constad inst336 (.result(inst336_result));
  not inst159 (\show-blue , inst1308_q);
  not inst167 (rect_only, trect);
  and inst140 (dist_en, inst1312_q, inst336_result);

  assign nSDI_RST = 1'b1;
  assign \RAM1-BWBn  = \RAM1-BWAn ;
  assign \RAM2-BWBn  = \RAM2-BWAn ;
  assign \RAM2-CLK  = \RAM1-CLK ;
  assign \RAM3-BWBn  = \RAM3-BWAn ;
  assign \RAM3-CLK  = \RAM1-CLK ;
  assign SDI_RX_BYPASS = 1'b0;

  // Other names for the same wires on the sheet: clk74 = clk_148_p; sdi_rx = sdi_rx_p;
  //   WR-FRAME[3:1] = {\RAM3-OEn , \RAM2-OEn , \RAM1-OEn }

  // Notes on the sheet:
  //   DEFAULT
  //   SDI IN/OUT
  //   SRAM 2MX18 (x3)
  //   SRAM 2MX18 (x3)
  //   VIDEO MASK
  //   ATMEL
  //   HTPA
  //   HTPA
  //   Targets input disable
  //   clk
  //   clk
  //   clk
endmodule
